# Altium project AMC_FMC_Carrier v3.PrjPcb (part 1 of 4)
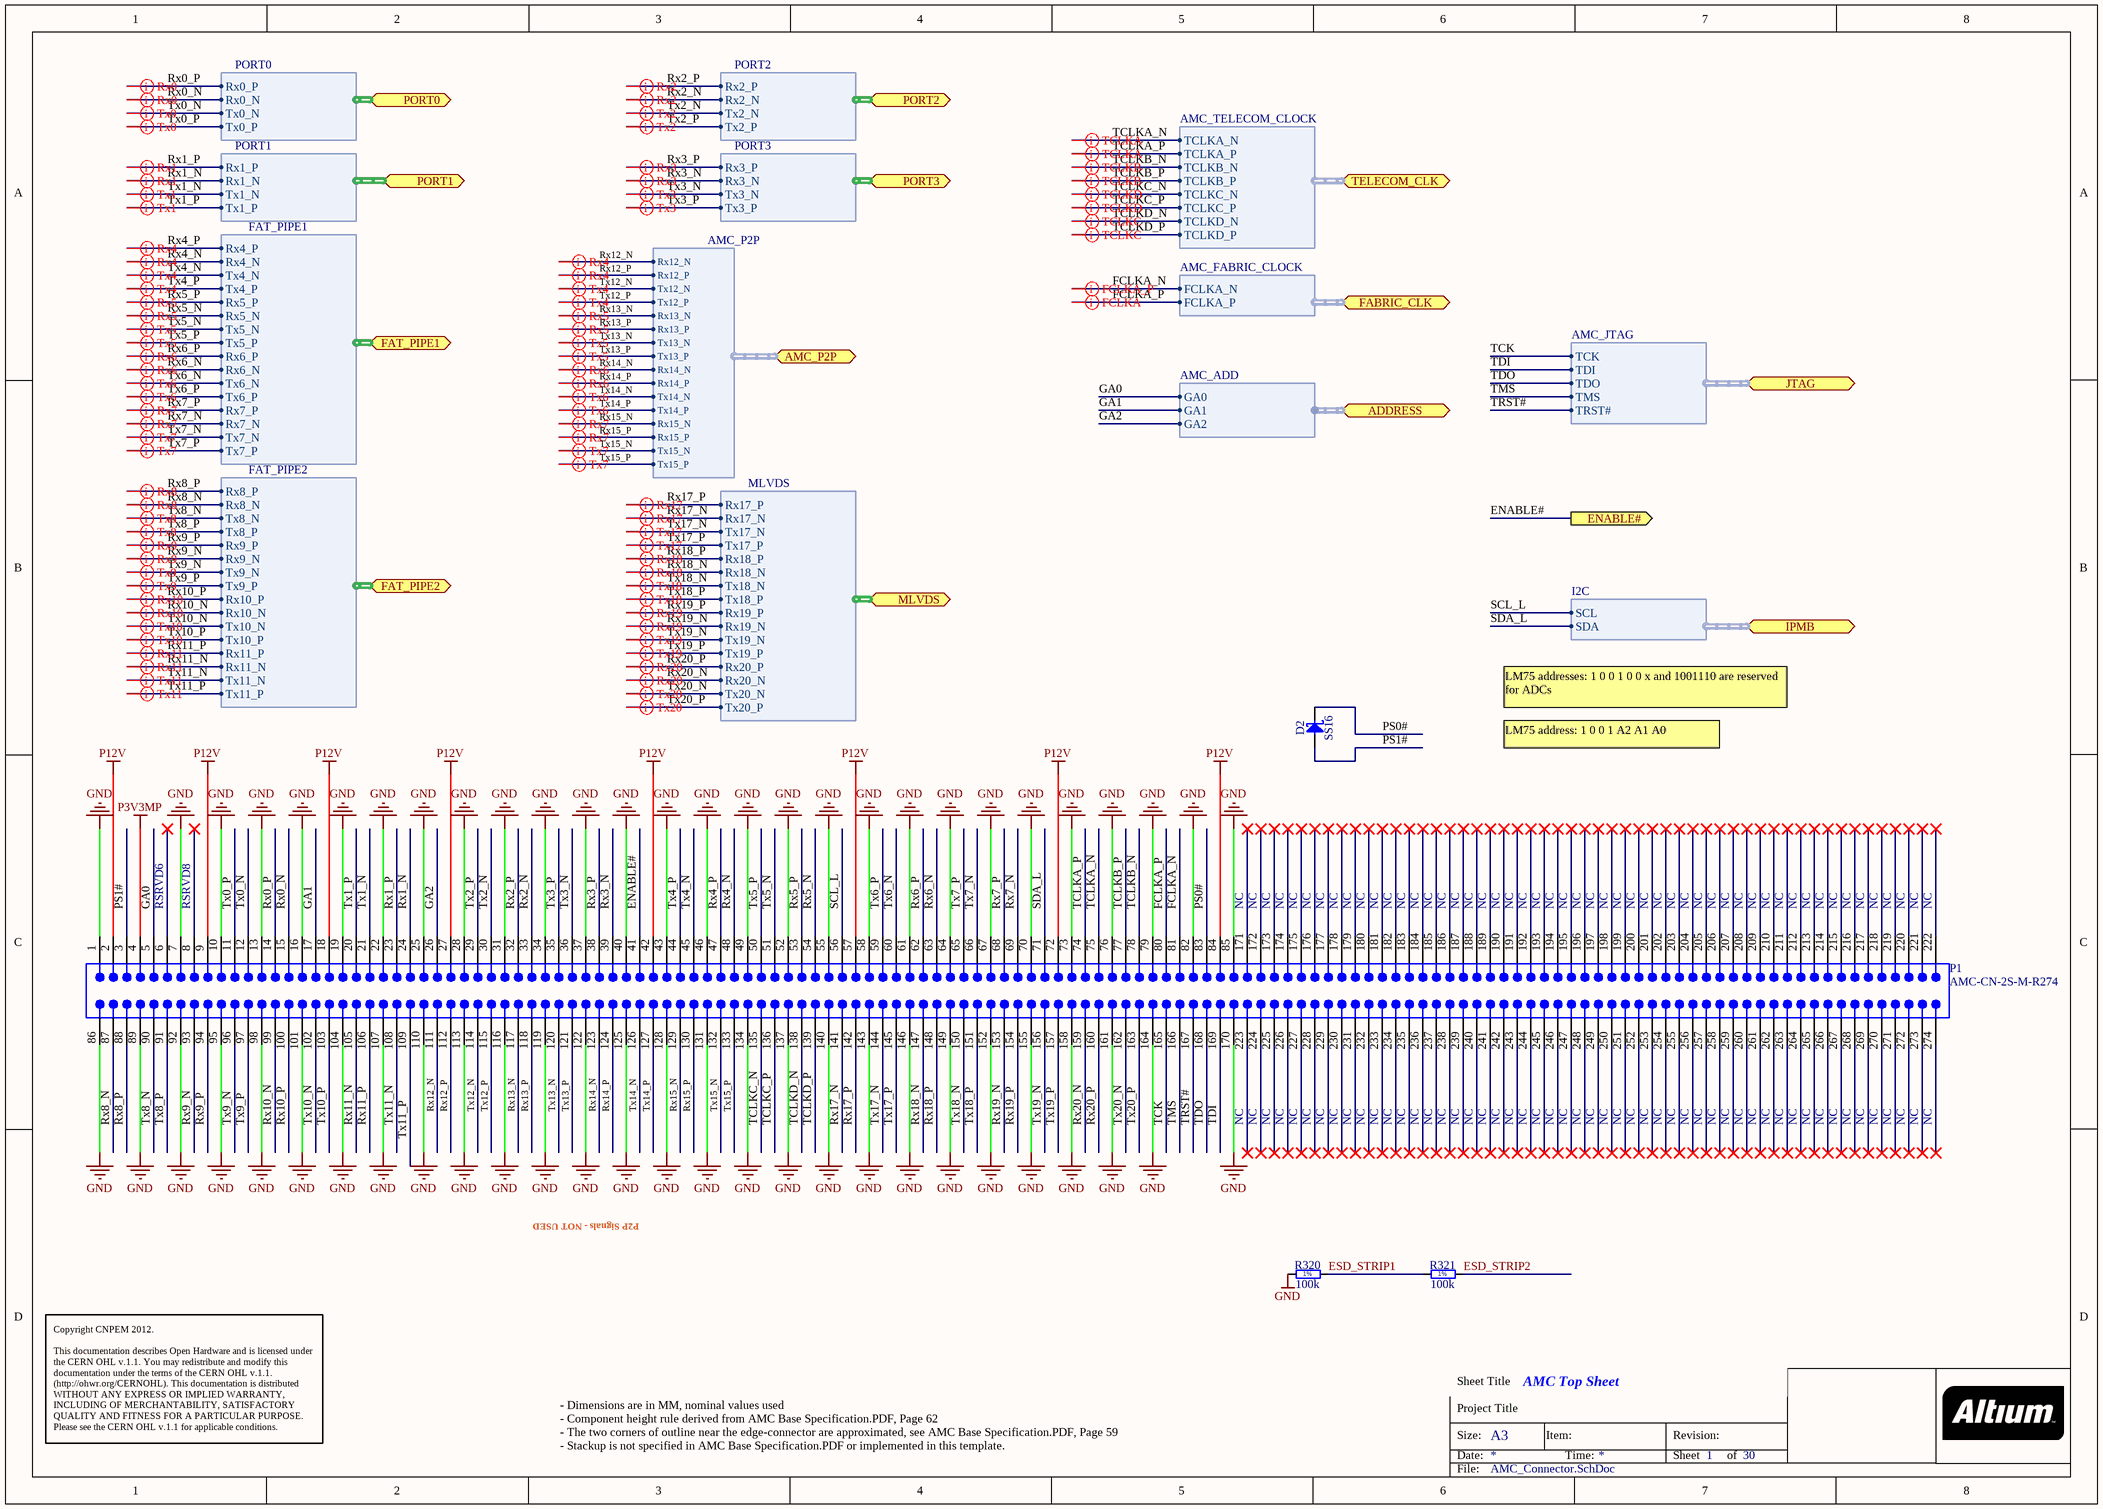
[diagram p0: AMC_Connector.SchDoc]
11 sheets, 421 parts. Net scope: hierarchical (ports join the sheet entries above them; power ports are global).
Board file: AMC_FMC_Carrier_v3.PcbDoc
Sheets:
  AMC_Connector.SchDoc
  FPGA.SchDoc
    FSDRAM = FPGA_SDRAM.SchDoc
    FMGT = FPGA_MGT.SchDoc
  POWER_Management.SchDoc
    SUP_12_18 = SUP_1.2_1.8.SchDoc
    UI = UI_mon.SchDoc
  RTM_CON.SchDoc
  AMC-SATA.SchDoc
  RTCE.SchDoc
  FMC_connector.SchDoc

## Sheet AMC_Connector.SchDoc: AMC Top Sheet
size A3; DocumentNumber: 1; Revision: 5; SheetNumber: 1; SheetTotal: 30; Organization: Altium Limited.

### Parts
D2  SS16  [DIOM5127X229N]
P1  AMC-CN-2S-M-R274  [AMC-GF-2D-750-O274]  (no BOM)
R320  100k  [RESC3216X65N]
R321  100k  [RESC3216X65N]

### Ports
ADDRESS (harness AMC_ADD), AMC_P2P (harness AMC_P2P), ENABLE# (out), FABRIC_CLK (harness AMC_FABRIC_CLOCK), FAT_PIPE1 (harness FAT_PIPE1), FAT_PIPE2 (harness FAT_PIPE2), IPMB (harness I2C), JTAG (harness AMC_JTAG), MLVDS (harness MLVDS), PORT0 (harness PORT0), PORT1 (harness PORT1), PORT2 (harness PORT2), PORT3 (harness PORT3), TELECOM_CLK (harness AMC_TELECOM_CLOCK)

### Harnesses
AMC_JTAG: TCK, TDI, TDO, TMS, TRST#
AMC_TELECOM_CLOCK: TCLKA_N, TCLKA_P, TCLKB_N, TCLKB_P, TCLKC_N, TCLKC_P, TCLKD_N, TCLKD_P
AMC_FABRIC_CLOCK: FCLKA_N, FCLKA_P
I2C: SCL, SDA
PORT0: Rx0_P, Rx0_N, Tx0_N, Tx0_P
PORT1: Rx1_P, Rx1_N, Tx1_N, Tx1_P
FAT_PIPE1: Rx4_P, Rx4_N, Tx4_N, Tx4_P, Rx5_P, Rx5_N, Tx5_N, Tx5_P, Rx6_P, Rx6_N, Tx6_N, Tx6_P, Rx7_P, Rx7_N, Tx7_N, Tx7_P
FAT_PIPE2: Rx8_P, Rx8_N, Tx8_N, Tx8_P, Rx9_P, Rx9_N, Tx9_N, Tx9_P, Rx10_P, Rx10_N, Tx10_N, Tx10_P, Rx11_P, Rx11_N, Tx11_N, Tx11_P
MLVDS: Rx17_P, Rx17_N, Tx17_N, Tx17_P, Rx18_P, Rx18_N, Tx18_N, Tx18_P, Rx19_P, Rx19_N, Tx19_N, Tx19_P, Rx20_P, Rx20_N, Tx20_N, Tx20_P
PORT2: Rx2_P, Rx2_N, Tx2_N, Tx2_P
PORT3: Rx3_P, Rx3_N, Tx3_N, Tx3_P
AMC_ADD: GA0, GA1, GA2
AMC_P2P: Rx12_N, Rx12_P, Tx12_N, Tx12_P, Rx13_N, Rx13_P, Tx13_N, Tx13_P, Rx14_N, Rx14_P, Tx14_N, Tx14_P, Rx15_N, Rx15_P, Tx15_N, Tx15_P

### Nets
GND: P1.1 P1.7 P1.10 P1.13 P1.16 P1.19 P1.22 P1.25 P1.28 P1.31 P1.34 P1.37 P1.40 P1.43 P1.46 P1.49 P1.52 P1.55 P1.58 P1.61 P1.64 P1.67 P1.70 P1.73 P1.76 P1.79 P1.82 P1.85 P1.86 P1.89 P1.92 P1.95 P1.98 P1.101 P1.104 P1.107 P1.110 P1.113 P1.116 P1.119 P1.122 P1.125 P1.128 P1.131 P1.134 P1.137 P1.140 P1.143 P1.146 P1.149 P1.152 P1.155 P1.158 P1.161 P1.164 P1.170 R320.1
P3V3MP: P1.4
P12V: P1.2 P1.9 P1.18 P1.27 P1.42 P1.57 P1.72 P1.84
ENABLE#: P1.41 ; port ENABLE#
ESD_STRIP1: R320.2 R321.1
ESD_STRIP2: R321.2
FCLKA_N: P1.81 ; port FABRIC_CLK.FCLKA_N
FCLKA_P: P1.80 ; port FABRIC_CLK.FCLKA_P
GA0: P1.5 ; port ADDRESS.GA0
GA1: P1.17 ; port ADDRESS.GA1
GA2: P1.26 ; port ADDRESS.GA2
PS0#: D2.1(C) P1.83
PS1#: D2.2(A) P1.3
Rx0_N: P1.15 ; port PORT0.Rx0_N
Rx0_P: P1.14 ; port PORT0.Rx0_P
Rx1_N: P1.24 ; port PORT1.Rx1_N
Rx1_P: P1.23 ; port PORT1.Rx1_P
Rx2_N: P1.33 ; port PORT2.Rx2_N
Rx2_P: P1.32 ; port PORT2.Rx2_P
Rx3_N: P1.39 ; port PORT3.Rx3_N
Rx3_P: P1.38 ; port PORT3.Rx3_P
Rx4_N: P1.48 ; port FAT_PIPE1.Rx4_N
Rx4_P: P1.47 ; port FAT_PIPE1.Rx4_P
Rx5_N: P1.54 ; port FAT_PIPE1.Rx5_N
Rx5_P: P1.53 ; port FAT_PIPE1.Rx5_P
Rx6_N: P1.63 ; port FAT_PIPE1.Rx6_N
Rx6_P: P1.62 ; port FAT_PIPE1.Rx6_P
Rx7_N: P1.69 ; port FAT_PIPE1.Rx7_N
Rx7_P: P1.68 ; port FAT_PIPE1.Rx7_P
Rx8_N: P1.87 ; port FAT_PIPE2.Rx8_N
Rx8_P: P1.88 ; port FAT_PIPE2.Rx8_P
Rx9_N: P1.93 ; port FAT_PIPE2.Rx9_N
Rx9_P: P1.94 ; port FAT_PIPE2.Rx9_P
Rx10_N: P1.99 ; port FAT_PIPE2.Rx10_N
Rx10_P: P1.100 ; port FAT_PIPE2.Rx10_P
Rx11_N: P1.105 ; port FAT_PIPE2.Rx11_N
Rx11_P: P1.106 ; port FAT_PIPE2.Rx11_P
Rx12_N: P1.111 ; port AMC_P2P.Rx12_N
Rx12_P: P1.112 ; port AMC_P2P.Rx12_P
Rx13_N: P1.117 ; port AMC_P2P.Rx13_N
Rx13_P: P1.118 ; port AMC_P2P.Rx13_P
Rx14_N: P1.123 ; port AMC_P2P.Rx14_N
Rx14_P: P1.124 ; port AMC_P2P.Rx14_P
Rx15_N: P1.129 ; port AMC_P2P.Rx15_N
Rx15_P: P1.130 ; port AMC_P2P.Rx15_P
Rx17_N: P1.141 ; port MLVDS.Rx17_N
Rx17_P: P1.142 ; port MLVDS.Rx17_P
Rx18_N: P1.147 ; port MLVDS.Rx18_N
Rx18_P: P1.148 ; port MLVDS.Rx18_P
Rx19_N: P1.153 ; port MLVDS.Rx19_N
Rx19_P: P1.154 ; port MLVDS.Rx19_P
Rx20_N: P1.159 ; port MLVDS.Rx20_N
Rx20_P: P1.160 ; port MLVDS.Rx20_P
SCL_L: P1.56 ; port IPMB.SCL
SDA_L: P1.71 ; port IPMB.SDA
TCK: P1.165 ; port JTAG.TCK
TCLKA_N: P1.75 ; port TELECOM_CLK.TCLKA_N
TCLKA_P: P1.74 ; port TELECOM_CLK.TCLKA_P
TCLKB_N: P1.78 ; port TELECOM_CLK.TCLKB_N
TCLKB_P: P1.77 ; port TELECOM_CLK.TCLKB_P
TCLKC_N: P1.135 ; port TELECOM_CLK.TCLKC_N
TCLKC_P: P1.136 ; port TELECOM_CLK.TCLKC_P
TCLKD_N: P1.138 ; port TELECOM_CLK.TCLKD_N
TCLKD_P: P1.139 ; port TELECOM_CLK.TCLKD_P
TDI: P1.169 ; port JTAG.TDI
TDO: P1.168 ; port JTAG.TDO
TMS: P1.166 ; port JTAG.TMS
TRST#: P1.167 ; port JTAG.TRST#
Tx0_N: P1.12 ; port PORT0.Tx0_N
Tx0_P: P1.11 ; port PORT0.Tx0_P
Tx1_N: P1.21 ; port PORT1.Tx1_N
Tx1_P: P1.20 ; port PORT1.Tx1_P
Tx2_N: P1.30 ; port PORT2.Tx2_N
Tx2_P: P1.29 ; port PORT2.Tx2_P
Tx3_N: P1.36 ; port PORT3.Tx3_N
Tx3_P: P1.35 ; port PORT3.Tx3_P
Tx4_N: P1.45 ; port FAT_PIPE1.Tx4_N
Tx4_P: P1.44 ; port FAT_PIPE1.Tx4_P
Tx5_N: P1.51 ; port FAT_PIPE1.Tx5_N
Tx5_P: P1.50 ; port FAT_PIPE1.Tx5_P
Tx6_N: P1.60 ; port FAT_PIPE1.Tx6_N
Tx6_P: P1.59 ; port FAT_PIPE1.Tx6_P
Tx7_N: P1.66 ; port FAT_PIPE1.Tx7_N
Tx7_P: P1.65 ; port FAT_PIPE1.Tx7_P
Tx8_N: P1.90 ; port FAT_PIPE2.Tx8_N
Tx8_P: P1.91 ; port FAT_PIPE2.Tx8_P
Tx9_N: P1.96 ; port FAT_PIPE2.Tx9_N
Tx9_P: P1.97 ; port FAT_PIPE2.Tx9_P
Tx10_N: P1.102 ; port FAT_PIPE2.Tx10_N
Tx10_P: P1.103 ; port FAT_PIPE2.Tx10_P
Tx11_N: P1.108 ; port FAT_PIPE2.Tx11_N
Tx11_P: P1.109 ; port FAT_PIPE2.Tx11_P
Tx12_N: P1.114 ; port AMC_P2P.Tx12_N
Tx12_P: P1.115 ; port AMC_P2P.Tx12_P
Tx13_N: P1.120 ; port AMC_P2P.Tx13_N
Tx13_P: P1.121 ; port AMC_P2P.Tx13_P
Tx14_N: P1.126 ; port AMC_P2P.Tx14_N
Tx14_P: P1.127 ; port AMC_P2P.Tx14_P
Tx15_N: P1.132 ; port AMC_P2P.Tx15_N
Tx15_P: P1.133 ; port AMC_P2P.Tx15_P
Tx17_N: P1.144 ; port MLVDS.Tx17_N
Tx17_P: P1.145 ; port MLVDS.Tx17_P
Tx18_N: P1.150 ; port MLVDS.Tx18_N
Tx18_P: P1.151 ; port MLVDS.Tx18_P
Tx19_N: P1.156 ; port MLVDS.Tx19_N
Tx19_P: P1.157 ; port MLVDS.Tx19_P
Tx20_N: P1.162 ; port MLVDS.Tx20_N
Tx20_P: P1.163 ; port MLVDS.Tx20_P

Not connected (* = marked no-connect by the designer): P1 6* 8* 171* 172* 173* 174* 175* 176* 177* 178* 179* 180* 181* 182* 183* 184* 185* 186* 187* 188* 189* 190* 191* 192* 193* 194* 195* 196* 197* 198* 199* 200* 201* 202* 203* 204* 205* 206* 207* 208* 209* 210* 211* 212* 213* 214* 215* 216* 217* 218* 219* 220* 221* 222* 223* 224* 225* 226* 227* 228* 229* 230* 231* 232* 233* 234* 235* 236* 237* 238* 239* 240* 241* 242* 243* 244* 245* 246* 247* 248* 249* 250* 251* 252* 253* 254* 255* 256* 257* 258* 259* 260* 261* 262* 263* 264* 265* 266* 267* 268* 269* 270* 271* 272* 273* 274*

### Layout directives
differential pair: FCLKA_N, FCLKA_P, Rx0_N, Rx0_P, Rx1_N, Rx1_P, Rx2_N, Rx2_P, Rx3_N, Rx3_P, Rx4_N, Rx4_P, Rx5_N, Rx5_P, Rx6_N, Rx6_P, Rx7_N, Rx7_P, Rx8_N, Rx8_P, Rx9_N, Rx9_P, Rx10_N, Rx10_P, Rx11_N, Rx11_P, Rx12_N, Rx12_P, Rx13_N, Rx13_P, Rx14_N, Rx14_P, Rx15_N, Rx15_P, Rx17_N, Rx17_P, Rx18_N, Rx18_P, Rx19_N, Rx19_P, Rx20_N, Rx20_P, TCLKA_N, TCLKA_P, TCLKB_N, TCLKB_P, TCLKC_N, TCLKC_P, TCLKD_N, TCLKD_P, Tx0_N, Tx0_P, Tx1_N, Tx1_P, Tx2_N, Tx2_P, Tx3_N, Tx3_P, Tx4_N, Tx4_P, Tx5_N, Tx5_P, Tx6_N, Tx6_P, Tx7_N, Tx7_P, Tx8_N, Tx8_P, Tx9_N, Tx9_P, Tx10_N, Tx10_P, Tx11_N, Tx11_P, Tx12_N, Tx12_P, Tx13_N, Tx13_P, Tx14_N, Tx14_P, Tx15_N, Tx15_P, Tx17_N, Tx17_P, Tx18_N, Tx18_P, Tx19_N, Tx19_P, Tx20_N, Tx20_P

### Notes on the sheet
- LM75 addresses: 1 0 0 1 0 0 x and 1001110 are reserved for ADCs
- LM75 address: 1 0 0 1 A2 A1 A0
- RSRVD6
- RSRVD8
- NC
- P2P Signals - NOT USED
- Copyright CNPEM 2012.
  This documentation describes Open Hardware and is licensed under the CERN OHL v.1.1. You may redistribute and modify this documentation under the terms of the CERN OHL v.1.1. (http://ohwr.org/CERNOHL). This documentation is distributed WITHOUT ANY EXPRESS OR IMPLIED WARRANTY, INCLUDING OF MERCHANTABILITY, SATISFACTORY QUALITY AND FITNESS FOR A PARTICULAR PURPOSE. Please see the CERN OHL v.1.1 for applicable conditions.
- - Dimensions are in MM, nominal values used
  - Component height rule derived from AMC Base Specification.PDF, Page 62
  - The two corners of outline near the edge-connector are approximated, see AMC Base Specification.PDF, Page 59
  - Stackup is not specified in AMC Base Specification.PDF or implemented in this template.
- Sheet Title
- Project Title
- Size:
- Date:
- A3
- Item:
- Time:
- Revision:
- Sheet
- of
- File:
- (in symbol R1206_100K_1%_0.25W_100PPM) 1%

### Library data of the parts
D2 = SS16: Schottky Diode; Part Description: Surface Mount Schottky Barrier Rectifier; Manufacturer: VISHAY GENERAL SEMICONDUCTOR; Voltage: 60V; Power: 1A; Table: Diodes; Part Number: SS16; Component Kind: Standard; Component Type: Standard; Device: SS16; PackageDescription: DO-214-AC Molded Diode, Body 5.1x2.7mm, IPC Medium Density; Manufacturer Part Number: SS16; Pin Count: 2; Case: DO-214AC; Mounted: Yes; Socket: No; SMD: Yes; ComponentHeight: 2.29mm; HelpURL: \\cern.ch\dfs\Applications\Altium\Datasheets\SS16.pdf; Author: CERN DEM JLC; CreateDate: 2008-07-15; LatestRevisionDate: 2010-08-23
P1 = CMP-0001-00058-2: Golden finger, AMC, Dual, Opposite, Pitch 0.75mm, 170-Position; Package Version: rev2.0, Nov-2006; Mating Connector: Molex-0758000001; Datasheet Version: rev2.0, Nov-2006; ClassName: Edge Connector; Package Reference: AMC-GF-2D-750-O274; Publisher: Altium
R320 R321 = R1206_100K_1%_0.25W_100PPM: Resistor - 1%; Part Description: General Purpose Thick Film Chip Resistor; Manufacturer: GENERIC; Manufacturer1 Part Number: NRC12F1003TRF; Power: 0.25W; TC: ±100ppm/°C; Table: Resistors SMD; Part Number: R1206_100K_1%_0.25W_100PPM; Component Kind: Standard; Component Type: Standard; Pin Count: 2; Value: 100k; Status: Preferred; Tolerance: ±1%; Manufacturer Part Number: R1206_100K_1%_0.25W_100PPM; Case: 1206; Mounted: Yes; Socket: No; SMD: Yes; Manufacturer1 Example: NIC COMPONENT; Manufacturer1 ComponentHeight: 0.65mm; HelpURL: \\cern.ch\dfs\Applications\Altium\Datasheets\R1206_NIC_NRC.pdf; Author: CERN DEM JLC; CreateDate: 2007-12-03; LatestRevisionDate: 2008-03-13

## Sheet FPGA.SchDoc
size A3; DocumentNumber: 4; SheetNumber: 4; SheetTotal: 30
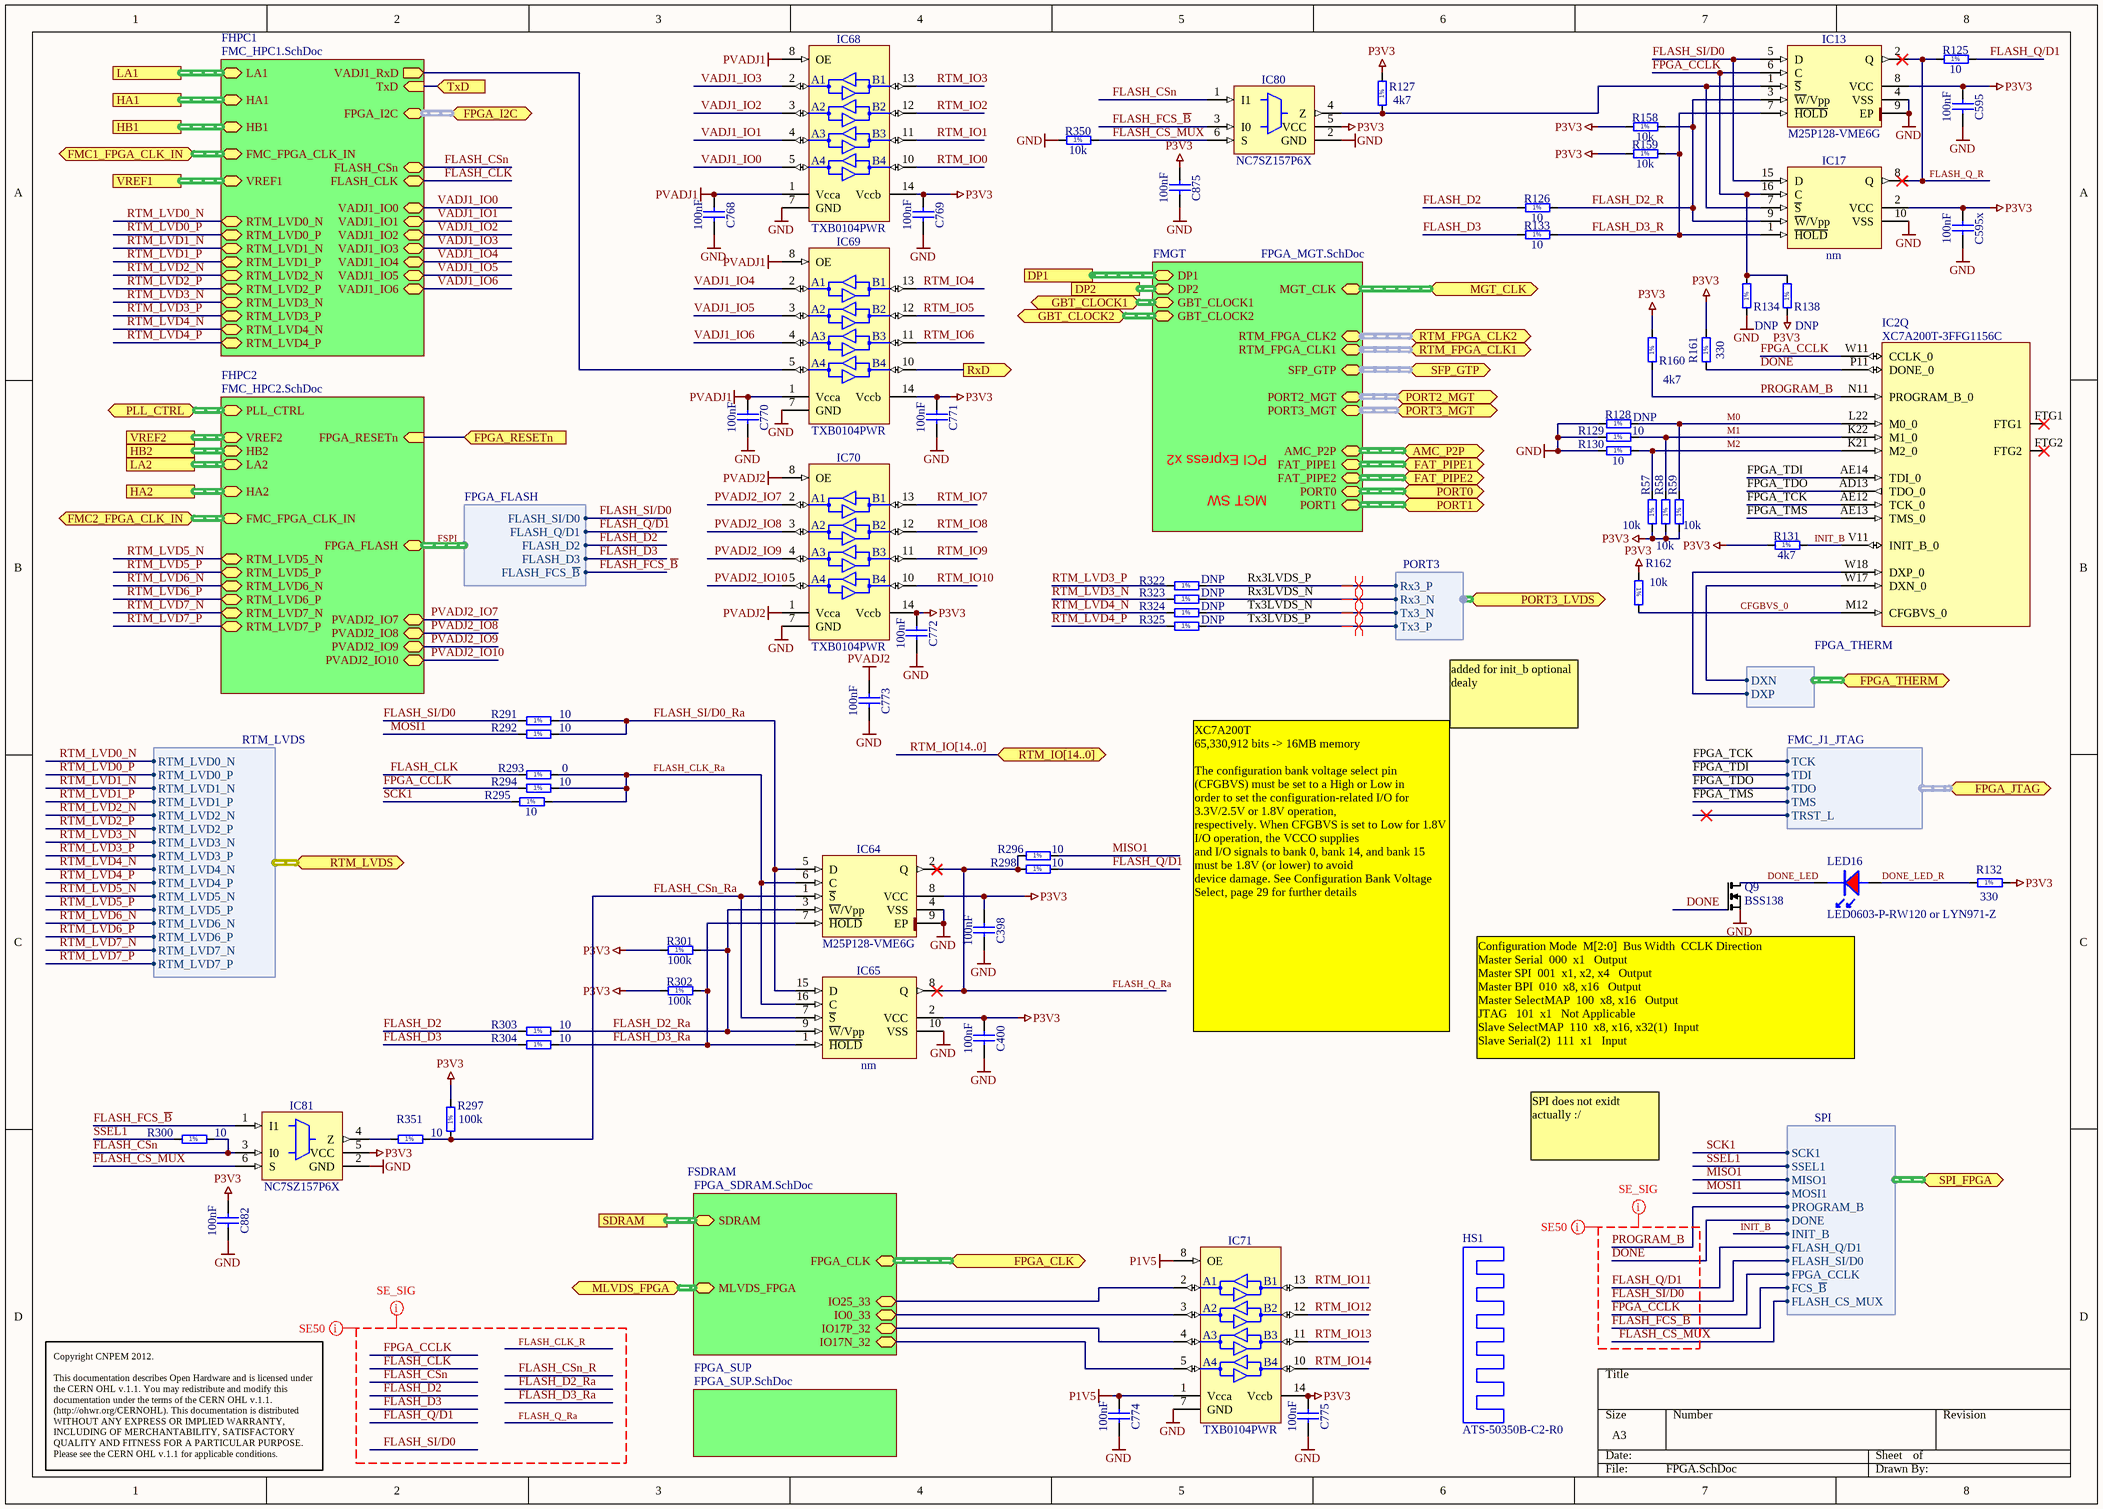
[diagram p1: FPGA.SchDoc]

### Parts
(Parts that share a designator on the sheet are numbered #1, #2 ... from top to bottom, then left to right.)
C398  100nF  [CAPC0603X33N]
C400  100nF  [CAPC0603X33N]
C595  100nF  [CAPC0603X33N]
C595x  100nF  [CAPC0603X33N]
C768  100nF  [CAPC0603X33N]
C769  100nF  [CAPC0603X33N]
C770  100nF  [CAPC0603X33N]
C771  100nF  [CAPC0603X33N]
C772  100nF  [CAPC0603X33N]
C773  100nF  [CAPC0603X33N]
C774  100nF  [CAPC0603X33N]
C775  100nF  [CAPC0603X33N]
C875  100nF  [CAPC0603X33N]
C882  100nF  [CAPC0603X33N]
HS1  ATS-50350B-C2-R0  [HEAT_SINK_ATS-50350B-C2-R0]
IC2#1  XC7A200T-3FFG1156C  [BGA1156C100P34X34_3500X3500X335]  (part Q of 23)
IC13  M25P128-VME6G  [PSON127P800X600X100-9N-R640X480]
IC17  nm  [SOIC127P1030X265-16N]
IC64  M25P128-VME6G  [PSON127P800X600X100-9N-R640X480]
IC65  nm  [SOIC127P1030X265-16N]
IC68  TXB0104PWR  [SOP65P640X120-14N]
IC69  TXB0104PWR  [SOP65P640X120-14N]
IC70  TXB0104PWR  [SOP65P640X120-14N]
IC71  TXB0104PWR  [SOP65P640X120-14N]
IC80  NC7SZ157P6X  [SOT65P210X110-6N]
IC81  NC7SZ157P6X  [SOT65P210X110-6N]
LED16  LED0603-P-RW120 or LYN971-Z  [led_0603R]
Q9  BSS138  [SOT95P251X112-3N]
R57  10k  [RESC1005X40N]
R58  10k  [RESC1005X40N]
R59  10k  [RESC1005X40N]
R125  10  [RESC1005X40N]
R126  10  [RESC1005X40N]
R127  4k7  [RESC1005X40N]
R128  DNP  [RESC1005X40N]
R129  10  [RESC1005X40N]
R130  10  [RESC1005X40N]
R131  4k7  [RESC1005X40N]
R132  330  [RESC1005X40N]
R133  10  [RESC1005X40N]
R134  DNP  [RESC1005X40N]
R138  DNP  [RESC1005X40N]
R158  10k  [RESC1005X40N]
R159  10k  [RESC1005X40N]
R160  4k7  [RESC1005X40N]
R161  330  [RESC1005X40N]
R162  10k  [RESC1005X40N]
R291  10  [RESC1005X40N]
R292  10  [RESC1005X40N]
R293  0  [RESC1005X40N]
R294  10  [RESC1005X40N]
R295  10  [RESC1005X40N]
R296  10  [RESC1005X40N]
R297  100k  [RESC1005X40N]
R298  10  [RESC1005X40N]
R300  10  [RESC1005X40N]
R301  100k  [RESC1005X40N]
R302  100k  [RESC1005X40N]
R303  10  [RESC1005X40N]
R304  10  [RESC1005X40N]
R322  DNP  [RESC1005X40N]
R323  DNP  [RESC1005X40N]
R324  DNP  [RESC1005X40N]
R325  DNP  [RESC1005X40N]
R350  10k  [RESC1005X40N]
R351  10  [RESC1005X40N]

### Sub-sheets
FHPC1 = FMC_HPC1.SchDoc (file not in this document): LA1 (harness FMC_J1_LA), HA1 (harness FMC_J1_HA), HB1 (harness FMC_J1_HB), VREF1 (harness FMC_J1_VREF), FMC_FPGA_CLK_IN (harness FMC_FPGA_CLK_IN), FPGA_I2C (harness I2C), FLASH_CLK, FLASH_CSn, VADJ1_RxD (out), TxD (in), VADJ1_IO0, VADJ1_IO1, VADJ1_IO2, VADJ1_IO3, VADJ1_IO4, VADJ1_IO5, VADJ1_IO6, RTM_LVD0_N (bidir), RTM_LVD0_P (bidir), RTM_LVD1_N (bidir), RTM_LVD1_P (bidir), RTM_LVD2_N (bidir), RTM_LVD2_P (bidir), RTM_LVD3_N (bidir), RTM_LVD3_P (bidir), RTM_LVD4_N (bidir), RTM_LVD4_P (bidir)
FHPC2 = FMC_HPC2.SchDoc (file not in this document): VREF2 (harness FMC_J1_VREF), HB2 (harness FMC_J1_HB), LA2 (harness FMC_J1_LA), HA2 (harness FMC_J1_HA), FPGA_FLASH (harness FPGA_FLASH), FMC_FPGA_CLK_IN (harness FMC_FPGA_CLK_IN), PLL_CTRL (harness PLL_CTRL), FPGA_RESETn (in), PVADJ2_IO7, PVADJ2_IO8, PVADJ2_IO9, PVADJ2_IO10, RTM_LVD5_N (bidir), RTM_LVD5_P (bidir), RTM_LVD6_N (bidir), RTM_LVD6_P (bidir), RTM_LVD7_N (bidir), RTM_LVD7_P (bidir)
FMGT = FPGA_MGT.SchDoc: DP1 (harness FMC_J1_DP), DP2 (harness FMC_J1_DP), FAT_PIPE1 (harness FAT_PIPE1), FAT_PIPE2 (harness FAT_PIPE2), PORT0 (harness PORT0), PORT1 (harness PORT1), GBT_CLOCK1 (harness GBT_CLOCK), GBT_CLOCK2 (harness GBT_CLOCK), MGT_CLK (harness MGT_CLK), PORT2_MGT, PORT3_MGT, SFP_GTP, RTM_FPGA_CLK2 (harness CLK_DIFF), RTM_FPGA_CLK1 (harness CLK_DIFF), AMC_P2P
FPGA_SUP = FPGA_SUP.SchDoc (file not in this document): no entries
FSDRAM = FPGA_SDRAM.SchDoc: SDRAM (harness DDR), MLVDS_FPGA (harness MLVDS-FPGA), FPGA_CLK (harness FPGA_SDRAM_CLK), IO25_33 (bidir), IO0_33 (bidir), IO17N_32 (bidir), IO17P_32 (bidir)

### Ports
AMC_P2P (harness AMC_P2P), DP1, DP2, FAT_PIPE1, FAT_PIPE2, FMC1_FPGA_CLK_IN, FMC2_FPGA_CLK_IN, FPGA_CLK, FPGA_I2C (harness I2C), FPGA_JTAG (harness FMC_J1_JTAG), FPGA_RESETn (in), FPGA_THERM (harness FPGA_THERM), GBT_CLOCK1, GBT_CLOCK2, HA1, HA2, HB1, HB2, LA1, LA2, MGT_CLK, MLVDS_FPGA, PLL_CTRL (harness PLL_CTRL), PORT0, PORT1, PORT2_MGT (harness PORT2), PORT3_LVDS (harness PORT3), PORT3_MGT (harness PORT3), RTM_FPGA_CLK1 (harness CLK_DIFF), RTM_FPGA_CLK2 (harness CLK_DIFF), RTM_IO[14..0] (bidir), RTM_LVDS (harness RTM_LVDS), RxD (out), SDRAM (harness DDR), SFP_GTP (harness SFP_GTP), SPI_FPGA (harness SPI), TxD (in), VREF1 (harness FMC_J1_VREF), VREF2 (harness FMC_J1_VREF)

### Harnesses
FMC_J1_JTAG: TCK, TDI, TDO, TMS, TRST_L
FPGA_THERM: DXN, DXP
SPI: SCK1, SSEL1, MISO1, MOSI1, FLASH_Q/D1, FLASH_SI/D0, PROGRAM_B, DONE, FPGA_CCLK, FCS_~{B}, INIT_B, FLASH_CS_MUX
FPGA_FLASH: FLASH_FCS_~{B}, FLASH_D3, FLASH_D2, FLASH_Q/D1, FLASH_SI/D0
RTM_LVDS: RTM_LVD0_N, RTM_LVD0_P, RTM_LVD1_N, RTM_LVD1_P, RTM_LVD2_N, RTM_LVD2_P, RTM_LVD3_N, RTM_LVD3_P, RTM_LVD4_N, RTM_LVD4_P, RTM_LVD5_N, RTM_LVD5_P, RTM_LVD6_N, RTM_LVD6_P, RTM_LVD7_N, RTM_LVD7_P
PORT3: Rx3_P, Rx3_N, Tx3_N, Tx3_P

### Nets
GND: C398.2 C400.2 C595.2 C595x.2 C768.2 C769.2 C770.2 C771.2 C772.2 C773.2 C774.2 C775.2 C875.2 C882.2 IC13.4(VSS) IC13.9(EP) IC17.10(VSS) IC64.4(VSS) IC64.9(EP) IC65.10(VSS) IC68.7(GND) IC69.7(GND) IC70.7(GND) IC71.7(GND) IC80.2(GND) IC81.2(GND) Q9.2(S) R128.1 R129.1 R130.1 R134.1 R350.1
P1V5: C774.1 IC71.1(Vcca) IC71.8(OE)
P3V3: C398.1 C400.1 C595.1 C595x.1 C769.1 C771.1 C772.1 C775.1 C875.1 C882.1 IC13.8(VCC) IC17.2(VCC) IC64.8(VCC) IC65.2(VCC) IC68.14(Vccb) IC69.14(Vccb) IC70.14(Vccb) IC71.14(Vccb) IC80.5(VCC) IC81.5(VCC) R57.1 R58.1 R59.1 R127.2 R131.1 R132.2 R138.1 R158.1 R159.1 R160.2 R161.2 R162.1 R297.2 R301.1 R302.1  [also labelled VCC]
PVADJ1: C768.1 C770.1 IC68.1(Vcca) IC68.8(OE) IC69.1(Vcca) IC69.8(OE)
PVADJ2: C773.1 IC70.1(Vcca) IC70.8(OE)
CFGBVS_0: IC2#1.M12(CFGBVS_0) R162.2
DONE: IC2#1.P11(DONE_0) Q9.1(G) R161.1 ; port SPI_FPGA.DONE
DONE_LED: LED16.K Q9.3(D)
DONE_LED_R: LED16.A R132.1
FLASH_CLK: R293.1 ; sheet FHPC1/FLASH_CLK
FLASH_CLK_Ra: IC64.6(C) IC65.16(C) R293.2 R294.2 R295.2
FLASH_CS_MUX: IC80.6(S) IC81.6(S) R350.2 ; port SPI_FPGA.FLASH_CS_MUX
FLASH_CSn: IC80.1(I1) IC81.3(I0) R300.2 ; sheet FHPC1/FLASH_CSn
FLASH_CSn_Ra: IC64.1(~{S}) IC65.7(~{S}) R297.1 R351.2
FLASH_D2: R126.1 R303.1 ; sheet FHPC2/FPGA_FLASH.FLASH_D2
FLASH_D2_R: IC13.3(~{W}/Vpp) IC17.9(~{W}/Vpp) R126.2 R158.2
FLASH_D2_Ra: IC64.3(~{W}/Vpp) IC65.9(~{W}/Vpp) R301.2 R303.2
FLASH_D3: R133.1 R304.1 ; sheet FHPC2/FPGA_FLASH.FLASH_D3
FLASH_D3_R: IC13.7(~{HOLD}) IC17.1(~{HOLD}) R133.2 R159.2
FLASH_D3_Ra: IC64.7(~{HOLD}) IC65.1(~{HOLD}) R302.2 R304.2
FLASH_FCS_~{B}: IC80.3(I0) IC81.1(I1) ; port SPI_FPGA.FCS_~{B}, sheet FHPC2/FPGA_FLASH.FLASH_FCS_~{B}
FLASH_Q/D1: R125.2 R298.2 ; port SPI_FPGA.FLASH_Q/D1, sheet FHPC2/FPGA_FLASH.FLASH_Q/D1
FLASH_Q_R: IC13.2(Q) IC17.8(Q) R125.1
FLASH_Q_Ra: IC64.2(Q) IC65.8(Q) R296.1 R298.1
FLASH_SI/D0: IC13.5(D) IC17.15(D) R291.1 ; port SPI_FPGA.FLASH_SI/D0, sheet FHPC2/FPGA_FLASH.FLASH_SI/D0
FLASH_SI/D0_Ra: IC64.5(D) IC65.15(D) R291.2 R292.2
FPGA_CCLK: IC2#1.W11(CCLK_0) IC13.6(C) IC17.16(C) R134.2 R138.2 R294.1 ; port SPI_FPGA.FPGA_CCLK
FPGA_RESETn: port FPGA_RESETn, sheet FHPC2/FPGA_RESETn
FPGA_TCK: IC2#1.AE12(TCK_0) ; port FPGA_JTAG.TCK
FPGA_TDI: IC2#1.AE14(TDI_0) ; port FPGA_JTAG.TDI
FPGA_TDO: IC2#1.AD13(TDO_0) ; port FPGA_JTAG.TDO
FPGA_TMS: IC2#1.AE13(TMS_0) ; port FPGA_JTAG.TMS
INIT_B: IC2#1.V11(INIT_B_0) R131.2 ; port SPI_FPGA.INIT_B
IO0_33: IC71.3(A2) ; sheet FSDRAM/IO0_33
IO17N_32: IC71.5(A4) ; sheet FSDRAM/IO17N_32
IO17P_32: IC71.4(A3) ; sheet FSDRAM/IO17P_32
IO25_33: IC71.2(A1) ; sheet FSDRAM/IO25_33
M0: IC2#1.L22(M0_0) R59.2 R128.2
M1: IC2#1.K22(M1_0) R58.2 R129.2
M2: IC2#1.K21(M2_0) R57.2 R130.2
MISO1: R296.2 ; port SPI_FPGA.MISO1
MOSI1: R292.1 ; port SPI_FPGA.MOSI1
PROGRAM_B: IC2#1.N11(PROGRAM_B_0) R160.1 ; port SPI_FPGA.PROGRAM_B
PVADJ2_IO7: IC70.2(A1) ; sheet FHPC2/PVADJ2_IO7
PVADJ2_IO8: IC70.3(A2) ; sheet FHPC2/PVADJ2_IO8
PVADJ2_IO9: IC70.4(A3) ; sheet FHPC2/PVADJ2_IO9
PVADJ2_IO10: IC70.5(A4) ; sheet FHPC2/PVADJ2_IO10
RTM_IO0: IC68.10(B4)
RTM_IO1: IC68.11(B3)
RTM_IO2: IC68.12(B2)
RTM_IO3: IC68.13(B1)
RTM_IO4: IC69.13(B1)
RTM_IO5: IC69.12(B2)
RTM_IO6: IC69.11(B3)
RTM_IO7: IC70.13(B1)
RTM_IO8: IC70.12(B2)
RTM_IO9: IC70.11(B3)
RTM_IO10: IC70.10(B4)
RTM_IO11: IC71.13(B1)
RTM_IO12: IC71.12(B2)
RTM_IO13: IC71.11(B3)
RTM_IO14: IC71.10(B4)
RTM_LVD0_N: sheet FHPC1/RTM_LVD0_N, port RTM_LVDS.RTM_LVD0_N
RTM_LVD0_P: sheet FHPC1/RTM_LVD0_P, port RTM_LVDS.RTM_LVD0_P
RTM_LVD1_N: sheet FHPC1/RTM_LVD1_N, port RTM_LVDS.RTM_LVD1_N
RTM_LVD1_P: sheet FHPC1/RTM_LVD1_P, port RTM_LVDS.RTM_LVD1_P
RTM_LVD2_N: sheet FHPC1/RTM_LVD2_N, port RTM_LVDS.RTM_LVD2_N
RTM_LVD2_P: sheet FHPC1/RTM_LVD2_P, port RTM_LVDS.RTM_LVD2_P
RTM_LVD3_N: R323.1 ; sheet FHPC1/RTM_LVD3_N, port RTM_LVDS.RTM_LVD3_N
RTM_LVD3_P: R322.1 ; sheet FHPC1/RTM_LVD3_P, port RTM_LVDS.RTM_LVD3_P
RTM_LVD4_N: R324.1 ; sheet FHPC1/RTM_LVD4_N, port RTM_LVDS.RTM_LVD4_N
RTM_LVD4_P: R325.1 ; sheet FHPC1/RTM_LVD4_P, port RTM_LVDS.RTM_LVD4_P
RTM_LVD5_N: sheet FHPC2/RTM_LVD5_N, port RTM_LVDS.RTM_LVD5_N
RTM_LVD5_P: sheet FHPC2/RTM_LVD5_P, port RTM_LVDS.RTM_LVD5_P
RTM_LVD6_N: sheet FHPC2/RTM_LVD6_N, port RTM_LVDS.RTM_LVD6_N
RTM_LVD6_P: sheet FHPC2/RTM_LVD6_P, port RTM_LVDS.RTM_LVD6_P
RTM_LVD7_N: sheet FHPC2/RTM_LVD7_N, port RTM_LVDS.RTM_LVD7_N
RTM_LVD7_P: sheet FHPC2/RTM_LVD7_P, port RTM_LVDS.RTM_LVD7_P
Rx3LVDS_N: R323.2 ; port PORT3_LVDS.Rx3_N
Rx3LVDS_P: R322.2 ; port PORT3_LVDS.Rx3_P
RxD: IC69.10(B4) ; port RxD
SCK1: R295.1 ; port SPI_FPGA.SCK1
SSEL1: R300.1 ; port SPI_FPGA.SSEL1
Tx3LVDS_N: R324.2 ; port PORT3_LVDS.Tx3_N
Tx3LVDS_P: R325.2 ; port PORT3_LVDS.Tx3_P
TxD: port TxD, sheet FHPC1/TxD
VADJ1_IO0: IC68.5(A4) ; sheet FHPC1/VADJ1_IO0
VADJ1_IO1: IC68.4(A3) ; sheet FHPC1/VADJ1_IO1
VADJ1_IO2: IC68.3(A2) ; sheet FHPC1/VADJ1_IO2
VADJ1_IO3: IC68.2(A1) ; sheet FHPC1/VADJ1_IO3
VADJ1_IO4: IC69.2(A1) ; sheet FHPC1/VADJ1_IO4
VADJ1_IO5: IC69.3(A2) ; sheet FHPC1/VADJ1_IO5
VADJ1_IO6: IC69.4(A3) ; sheet FHPC1/VADJ1_IO6
NetIC2#1_W17: IC2#1.W17(DXN_0) ; port FPGA_THERM.DXN
NetIC2#1_W18: IC2#1.W18(DXP_0) ; port FPGA_THERM.DXP
NetIC13_1: IC13.1(~{S}) IC17.7(~{S}) IC80.4(Z) R127.1
NetIC69_5: IC69.5(A4) ; sheet FHPC1/VADJ1_RxD
NetIC81_4: IC81.4(Z) R351.1

Not connected (* = marked no-connect by the designer): IC2#1 FTG1* FTG2*

### Buses and harness runs
bus RTM_IO[14..0] = port RTM_IO[14..0]
harness FSPI = sheet FHPC2/FPGA_FLASH
harness port AMC_P2P = sheet FMGT/AMC_P2P
harness port DP1 = sheet FMGT/DP1
harness port DP2 = sheet FMGT/DP2
harness port FAT_PIPE1 = sheet FMGT/FAT_PIPE1
harness port FAT_PIPE2 = sheet FMGT/FAT_PIPE2
harness port FMC1_FPGA_CLK_IN = sheet FHPC1/FMC_FPGA_CLK_IN
harness port FMC2_FPGA_CLK_IN = sheet FHPC2/FMC_FPGA_CLK_IN
harness port FPGA_CLK = sheet FSDRAM/FPGA_CLK
harness port FPGA_I2C = sheet FHPC1/FPGA_I2C
harness port GBT_CLOCK1 = sheet FMGT/GBT_CLOCK1
harness port GBT_CLOCK2 = sheet FMGT/GBT_CLOCK2
harness port HA1 = sheet FHPC1/HA1
harness port HA2 = sheet FHPC2/HA2
harness port HB1 = sheet FHPC1/HB1
harness port HB2 = sheet FHPC2/HB2
harness port LA1 = sheet FHPC1/LA1
harness port LA2 = sheet FHPC2/LA2
harness port MGT_CLK = sheet FMGT/MGT_CLK
harness port MLVDS_FPGA = sheet FSDRAM/MLVDS_FPGA
harness port PLL_CTRL = sheet FHPC2/PLL_CTRL
harness port PORT0 = sheet FMGT/PORT0
harness port PORT1 = sheet FMGT/PORT1
harness port PORT2_MGT = sheet FMGT/PORT2_MGT
harness port PORT3_MGT = sheet FMGT/PORT3_MGT
harness port RTM_FPGA_CLK1 = sheet FMGT/RTM_FPGA_CLK1
harness port RTM_FPGA_CLK2 = sheet FMGT/RTM_FPGA_CLK2
harness port SDRAM = sheet FSDRAM/SDRAM
harness port SFP_GTP = sheet FMGT/SFP_GTP
harness port VREF1 = sheet FHPC1/VREF1
harness port VREF2 = sheet FHPC2/VREF2

### Layout directives
net class SE_SIG: DONE, FLASH_CLK, FLASH_CLK_R, FLASH_CS_MUX, FLASH_CSn, FLASH_CSn_R, FLASH_D2, FLASH_D2_Ra, FLASH_D3, FLASH_D3_Ra, FLASH_FCS_~{B}, FLASH_Q/D1, FLASH_Q_Ra, FLASH_SI/D0, FPGA_CCLK, PROGRAM_B
net class SE50: DONE, FLASH_CLK, FLASH_CLK_R, FLASH_CS_MUX, FLASH_CSn, FLASH_CSn_R, FLASH_D2, FLASH_D2_Ra, FLASH_D3, FLASH_D3_Ra, FLASH_FCS_~{B}, FLASH_Q/D1, FLASH_Q_Ra, FLASH_SI/D0, FPGA_CCLK, PROGRAM_B
differential pair: Rx3LVDS_N, Rx3LVDS_P, Tx3LVDS_N, Tx3LVDS_P

### Notes on the sheet
- PCI Express x2
- MGT SW
- added for init_b optional dealy
- XC7A200T
  65,330,912 bits -> 16MB memory
  The configuration bank voltage select pin (CFGBVS) must be set to a High or Low in
  order to set the configuration-related I/O for 3.3V/2.5V or 1.8V operation,
  respectively. When CFGBVS is set to Low for 1.8V I/O operation, the VCCO supplies
  and I/O signals to bank 0, bank 14, and bank 15 must be 1.8V (or lower) to avoid
  device damage. See Configuration Bank Voltage Select, page 29 for further details
- (near Q9) Configuration Mode 	M[2:0] 	Bus Width 	CCLK Direction
  Master Serial 	000 	x1 		Output
  Master SPI 	001 	x1, x2, x4 		Output
  Master BPI 	010 	x8, x16 		Output
  Master SelectMAP 	100 	x8, x16 		Output
  JTAG 		101 	x1 		Not Applicable
  Slave SelectMAP 	110	 x8, x16, x32(1) 	Input
  Slave Serial(2) 	111 	x1 		Input
- SPI does not exidt actually :/
- Copyright CNPEM 2012.
  This documentation describes Open Hardware and is licensed under the CERN OHL v.1.1. You may redistribute and modify this documentation under the terms of the CERN OHL v.1.1. (http://ohwr.org/CERNOHL). This documentation is distributed WITHOUT ANY EXPRESS OR IMPLIED WARRANTY, INCLUDING OF MERCHANTABILITY, SATISFACTORY QUALITY AND FITNESS FOR A PARTICULAR PURPOSE. Please see the CERN OHL v.1.1 for applicable conditions.
- (in symbol R0402_0R_JUMPER) 1%
- (in symbol R0402_4K7_1%_0.0625W_100PPM) 1%
- (in symbol R0402_10K_1%_0.0625W_100PPM) 1%
- (in symbol R0402_10R_1%_0.0625W_200PPM) 1%
- (in symbol R0402_100K_1%_0.0625W_100PPM) 1%
- (in symbol R0402_100R_1%_0.0625W_100PPM) 1%
- (in symbol R0402_330R_1%_0.0625W_100PPM) 1%

### Library data of the parts
C398 C400 C595 C595x C768-C775 C875 C882 = CC0201_100NF_6.3V_10%_X5R: Non-polarised capacitor; Part Description: SMD Multilayer Chip Ceramic Capacitor; Manufacturer: GENERIC; Manufacturer1 Part Number: 02016D104KAT2A; Voltage: 6.3V; TC: X5R; Tolerance: ±10%; Table: Capacitors SMD; Part Number: CC0201_100NF_6.3V_10%_X5R; Component Kind: Standard; Component Type: Standard; Pin Count: 2; Value: 100nF; Status: Not Recommended; Manufacturer Part Number: CC0201_100NF_6.3V_10%_X5R; Case: 0201; Mounted: Yes; Socket: No; SMD: Yes; Manufacturer1 Example: AVX; Manufacturer1 ComponentHeight: 0.33mm; HelpURL: \\cern.ch\dfs\Applications\Altium\Datasheets\CC0201_X5R_AVX.pdf; Author: CERN DEM JLC; CreateDate: 2007-12-03; LatestRevisionDate: 2007-12-03
HS1 = HEAT_SINK_ATS-50350B-C2-R0: Heat sink BGA 35x35(44.9)mm
IC2#1 = XC7A350T-2FFG1156C: Artix-6 FPGA, 16 GTPs, 600 User I/Os, 1156-Pin BGA, Speed Grade 2, Commercial Grade, Pb-Free; Part Description: Artix-7 FPGA, 16 GTPs, 600 User I/Os, 1156-Pin BGA, Speed Grade 2, Commercial Grade, Pb-Free; Manufacturer: XILINX; Table: Logic; Part Number: XC7A200T-3FFG1156C; Component Kind: Standard; Component Type: Standard; Device: XC7A200T-3FFG1156C; PackageDescription: BGA, 1.00mm Pitch, Square; 1156 Pin, 34 Columns X 34 Rows, 35.00mm X 35.00mm X 3.350mm H; Manufacturer Part Number: XC7A200T-3FFG1156C; Pin Count: 1156; Case: BGA1156; Mounted: Yes; Socket: No; SMD: Yes; ComponentHeight: 3.35mm; HelpURL: \\cern.ch\dfs\Applications\Altium\Datasheets\XC7A350T-2FFG1156C.pdf; ComponentLink1URL: \\cern.ch\dfs\Applications\Altium\Datasheets\XC7A350T-2FFG1156C.pdf; ComponentLink1Description: Package/Pinout; Author: CERN DEM JLC; CreateDate: 2012-09-19; LatestRevisionDate: 2012-09-19
IC13 IC64 = M25P128-VME6G: 128 Mbit (Multilevel), low-voltage, Serial Flash memory with 50-MHz SPI bus interface; Manufacturer: NUMONYX; Table: Logic; Part Number: M25P128-VME6G; Component Kind: Standard; Component Type: Standard; Device: M25P128-VME6G; PackageDescription: SON,1.27mm,pitch; 8 pin,8.00mm W X 6.00mm L X 1.00mm H body (w/pullback leads,thermal tab 6.4 X 4.8mm), IPC Medium Density; Part Description: 128 Mbit (Multilevel), Low-Voltage, Serial Flash Memory With 50-MHz SPI Bus Interface; Manufacturer Part Number: M25P128-VME6G; Pin Count: 9; Case: SON8; Mounted: Yes; Socket: No; SMD: Yes; ComponentHeight: 1mm; HelpURL: \\cern.ch\dfs\Applications\Altium\Datasheets\M25P128-VME6G.pdf; Author: CERN DEM JLC; CreateDate: 2010-01-20; LatestRevisionDate: 2010-01-20
IC17 IC65 = M25P128-VMF6G: 128 Mbit (Multilevel), low-voltage, Serial Flash memory with 50-MHz SPI bus interface; Manufacturer: NUMONYX; Table: Logic; Part Number: M25P128-VMF6G; Component Kind: Standard; Component Type: Standard; Device: M25P128-VMF6G; PackageDescription: SOIC 16, Pitch 1.27mm - Body 7.5x10.3mm, IPC Medium Density; Part Description: 128 Mbit (Multilevel), Low-Voltage, Serial Flash Memory With 50-MHz SPI Bus Interface; Manufacturer Part Number: M25P128-VMF6G; Pin Count: 8; Case: SOIC16; Mounted: Yes; Socket: No; SMD: Yes; ComponentHeight: 2.65mm; HelpURL: \\cern.ch\dfs\Applications\Altium\Datasheets\M25P128-VMF6G.pdf; Author: CERN DEM JLC; CreateDate: 2010-01-20; LatestRevisionDate: 2010-10-21
IC68-IC71 = TXB0104PWR: 4-Bit Bidirectionnal Voltage-Level Translator; Part Description: 4-Bit Bidirectional Voltage-Level Translator with Automatic Direction Sensing and ±15kV ESD Protection; Manufacturer: TEXAS INSTRUMENTS; Table: Analog & Interface; Part Number: TXB0104PWR; Component Kind: Standard; Component Type: Standard; Device: TXB0104PWR; PackageDescription: SOP, 14-Leads, Body 5.1x4.5mm (max), Pitch 0.65mm, IPC Medium Density; Manufacturer Part Number: TXB0104PWR; Pin Count: 14; Case: TSSOP14; Mounted: Yes; Socket: No; SMD: Yes; ComponentHeight: 1.2mm; Author: CERN DEM JMW; HelpURL: \\cern.ch\dfs\Applications\Altium\Datasheets\TXB0104PWR.pdf; CreateDate: 2010-12-20; LatestRevisionDate: 2010-12-20
IC80 IC81 = NC7SZ157P6X: TinyLogic® UHS 2-Input Non-Inverting Multiplexer; Manufacturer: FAIRCHILD SEMICONDUCTOR; Table: Standard Logic; Part Number: NC7SZ157P6X; Component Kind: Standard; Component Type: Standard; Device: NC7SZ157P6X; PackageDescription: SOT363, 0.65mm pitch; 6 pin, 1.40mm W X 2.15mm L, IPC Medium Density; Part Description: TinyLogic® UHS 2-Input Non-Inverting Multiplexer; Manufacturer Part Number: NC7SZ157P6X; Pin Count: 6; Case: SOT363; Mounted: Yes; Socket: No; SMD: Yes; ComponentHeight: 1.1mm; Author: CERN DEM JLC; HelpURL: \\cern.ch\dfs\Applications\Altium\Datasheets\NC7SZ157P6X.pdf; CreateDate: 2012-03-22; LatestRevisionDate: 2012-03-22
LED16 = LED_0603R: LED 0603 red; Supplier 1: Newark; Supplier Part Number 1: 22M3004; Supplier 2: Newark; Supplier Part Number 2: 20M0618
Q9 = Q_BSS138
R57-R59 R158 R159 R162 R350 = R0402_10K_1%_0.0625W_100PPM: Resistor - 1%; Part Description: General Purpose Thick Film Chip Resistor; Manufacturer: GENERIC; Manufacturer1 Part Number: 232270671003L; TC: ±100ppm/°C; Table: Resistors SMD; Part Number: R0402_10K_1%_0.0625W_100PPM; Component Kind: Standard; Component Type: Standard; Pin Count: 2; Value: 10k; Status: Not recommended; Power: 0.0625W; Tolerance: ±1%; Manufacturer Part Number: R0402_10K_1%_0.0625W_100PPM; Case: 0402; Mounted: Yes; Socket: No; SMD: Yes; Manufacturer1 Example: YAGEO PHYCOMP; Manufacturer1 ComponentHeight: 0.4mm; HelpURL: \\cern.ch\dfs\Applications\Altium\Datasheets\R0402_Phycomp_RC0402.pdf; Author: CERN DEM JLC; CreateDate: 2007-12-03; LatestRevisionDate: 2012-10-17
R125 R126 R129 R130 R133 R291 R292 R294-R296 R298 R300 R303 R304 R351 = R0402_10R_1%_0.0625W_200PPM: Resistor - 1%; Part Description: General Purpose Thick Film Chip Resistor; Manufacturer: GENERIC; Manufacturer1 Part Number: 232270671009L; TC: ±200ppm/°C; Table: Resistors SMD; Part Number: R0402_10R_1%_0.0625W_200PPM; Component Kind: Standard; Component Type: Standard; Pin Count: 2; Value: 10; Status: Not recommended; Power: 0.0625W; Tolerance: ±1%; Manufacturer Part Number: R0402_10R_1%_0.0625W_200PPM; Case: 0402; Mounted: Yes; Socket: No; SMD: Yes; Manufacturer1 Example: YAGEO PHYCOMP; Manufacturer1 ComponentHeight: 0.4mm; HelpURL: \\cern.ch\dfs\Applications\Altium\Datasheets\R0402_Phycomp_RC0402.pdf; Author: CERN DEM JLC; CreateDate: 2009-06-24; LatestRevisionDate: 2012-10-17
R127 R131 R160 = R0402_4K7_1%_0.0625W_100PPM: Resistor - 1%; Part Description: General Purpose Thick Film Chip Resistor; Manufacturer: GENERIC; Manufacturer1 Part Number: 232270674702L; TC: ±100ppm/°C; Table: Resistors SMD; Part Number: R0402_4K7_1%_0.0625W_100PPM; Component Kind: Standard; Component Type: Standard; Pin Count: 2; Value: 4k7; Status: Not recommended; Power: 0.0625W; Tolerance: ±1%; Manufacturer Part Number: R0402_4K7_1%_0.0625W_100PPM; Case: 0402; Mounted: Yes; Socket: No; SMD: Yes; Manufacturer1 Example: YAGEO PHYCOMP; Manufacturer1 ComponentHeight: 0.4mm; HelpURL: \\cern.ch\dfs\Applications\Altium\Datasheets\R0402_Phycomp_RC0402.pdf; Author: CERN DEM JLC; CreateDate: 2007-12-03; LatestRevisionDate: 2012-10-17
R128 R322-R325 = R0402_0R_JUMPER: Resistor - 1%; Part Description: 1A (0.05R Max DC Resistance) Zero Ohm Jumper; Manufacturer: GENERIC; Manufacturer1 Part Number: 232270591001L; Value: 0; Table: Resistors SMD; Part Number: R0402_0R_JUMPER; Component Kind: Standard; Component Type: Standard; Pin Count: 2; Status: Not recommended; Manufacturer Part Number: R0402_0R_JUMPER; Case: 0402; Mounted: Yes; Socket: No; SMD: Yes; Manufacturer1 Example: YAGEO PHYCOMP; Manufacturer1 ComponentHeight: 0.4mm; HelpURL: \\cern.ch\dfs\Applications\Altium\Datasheets\R0402_Phycomp_RC0402.pdf; Author: CERN DEM JLC; CreateDate: 2007-12-03; LatestRevisionDate: 2012-10-17
R132 R161 = R0402_330R_1%_0.0625W_100PPM: Resistor - 1%; Part Description: General Purpose Thick Film Chip Resistor; Manufacturer: GENERIC; Manufacturer1 Part Number: 232270673301L; TC: ±100ppm/°C; Table: Resistors SMD; Part Number: R0402_330R_1%_0.0625W_100PPM; Component Kind: Standard; Component Type: Standard; Pin Count: 2; Value: 330; Status: Not recommended; Power: 0.0625W; Tolerance: ±1%; Manufacturer Part Number: R0402_330R_1%_0.0625W_100PPM; Case: 0402; Mounted: Yes; Socket: No; SMD: Yes; Manufacturer1 Example: YAGEO PHYCOMP; Manufacturer1 ComponentHeight: 0.4mm; HelpURL: \\cern.ch\dfs\Applications\Altium\Datasheets\R0402_Phycomp_RC0402.pdf; Author: CERN DEM JLC; CreateDate: 2007-12-03; LatestRevisionDate: 2012-10-17
R134 R138 = R0402_100R_1%_0.0625W_100PPM: Resistor - 1%; Part Description: General Purpose Thick Film Chip Resistor; Manufacturer: GENERIC; Manufacturer1 Part Number: 232270671001L; Value: 100; TC: ±100ppm/°C; Table: Resistors SMD; Part Number: R0402_100R_1%_0.0625W_100PPM; Component Kind: Standard; Component Type: Standard; Pin Count: 2; Status: Not recommended; Power: 0.0625W; Tolerance: ±1%; Manufacturer Part Number: R0402_100R_1%_0.0625W_100PPM; Case: 0402; Mounted: Yes; Socket: No; SMD: Yes; Manufacturer1 Example: YAGEO PHYCOMP; Manufacturer1 ComponentHeight: 0.4mm; HelpURL: \\cern.ch\dfs\Applications\Altium\Datasheets\R0402_Phycomp_RC0402.pdf; Author: CERN DEM JLC; CreateDate: 2007-12-03; LatestRevisionDate: 2012-10-17
R293 = R0402_0R_JUMPER: Resistor - 1%; Part Description: 1A (0.05R Max DC Resistance) Zero Ohm Jumper; Manufacturer: GENERIC; Manufacturer1 Part Number: 232270591001L; Table: Resistors SMD; Part Number: R0402_0R_JUMPER; Component Kind: Standard; Component Type: Standard; Pin Count: 2; Value: 0; Status: Not recommended; Manufacturer Part Number: R0402_0R_JUMPER; Case: 0402; Mounted: Yes; Socket: No; SMD: Yes; Manufacturer1 Example: YAGEO PHYCOMP; Manufacturer1 ComponentHeight: 0.4mm; HelpURL: \\cern.ch\dfs\Applications\Altium\Datasheets\R0402_Phycomp_RC0402.pdf; Author: CERN DEM JLC; CreateDate: 2007-12-03; LatestRevisionDate: 2012-10-17
R297 R301 R302 = R0402_100K_1%_0.0625W_100PPM: Resistor - 1%; Part Description: General Purpose Thick Film Chip Resistor; Manufacturer: GENERIC; Manufacturer1 Part Number: 232270671004L; TC: ±100ppm/°C; Table: Resistors SMD; Part Number: R0402_100K_1%_0.0625W_100PPM; Component Kind: Standard; Component Type: Standard; Pin Count: 2; Value: 100k; Status: Not recommended; Power: 0.0625W; Tolerance: ±1%; Manufacturer Part Number: R0402_100K_1%_0.0625W_100PPM; Case: 0402; Mounted: Yes; Socket: No; SMD: Yes; Manufacturer1 Example: YAGEO PHYCOMP; Manufacturer1 ComponentHeight: 0.4mm; HelpURL: \\cern.ch\dfs\Applications\Altium\Datasheets\R0402_Phycomp_RC0402.pdf; Author: CERN DEM JLC; CreateDate: 2007-12-03; LatestRevisionDate: 2012-10-17

## Sheet FPGA_SDRAM.SchDoc
size A3; DocumentNumber: 18; SheetNumber: 18; SheetTotal: 30
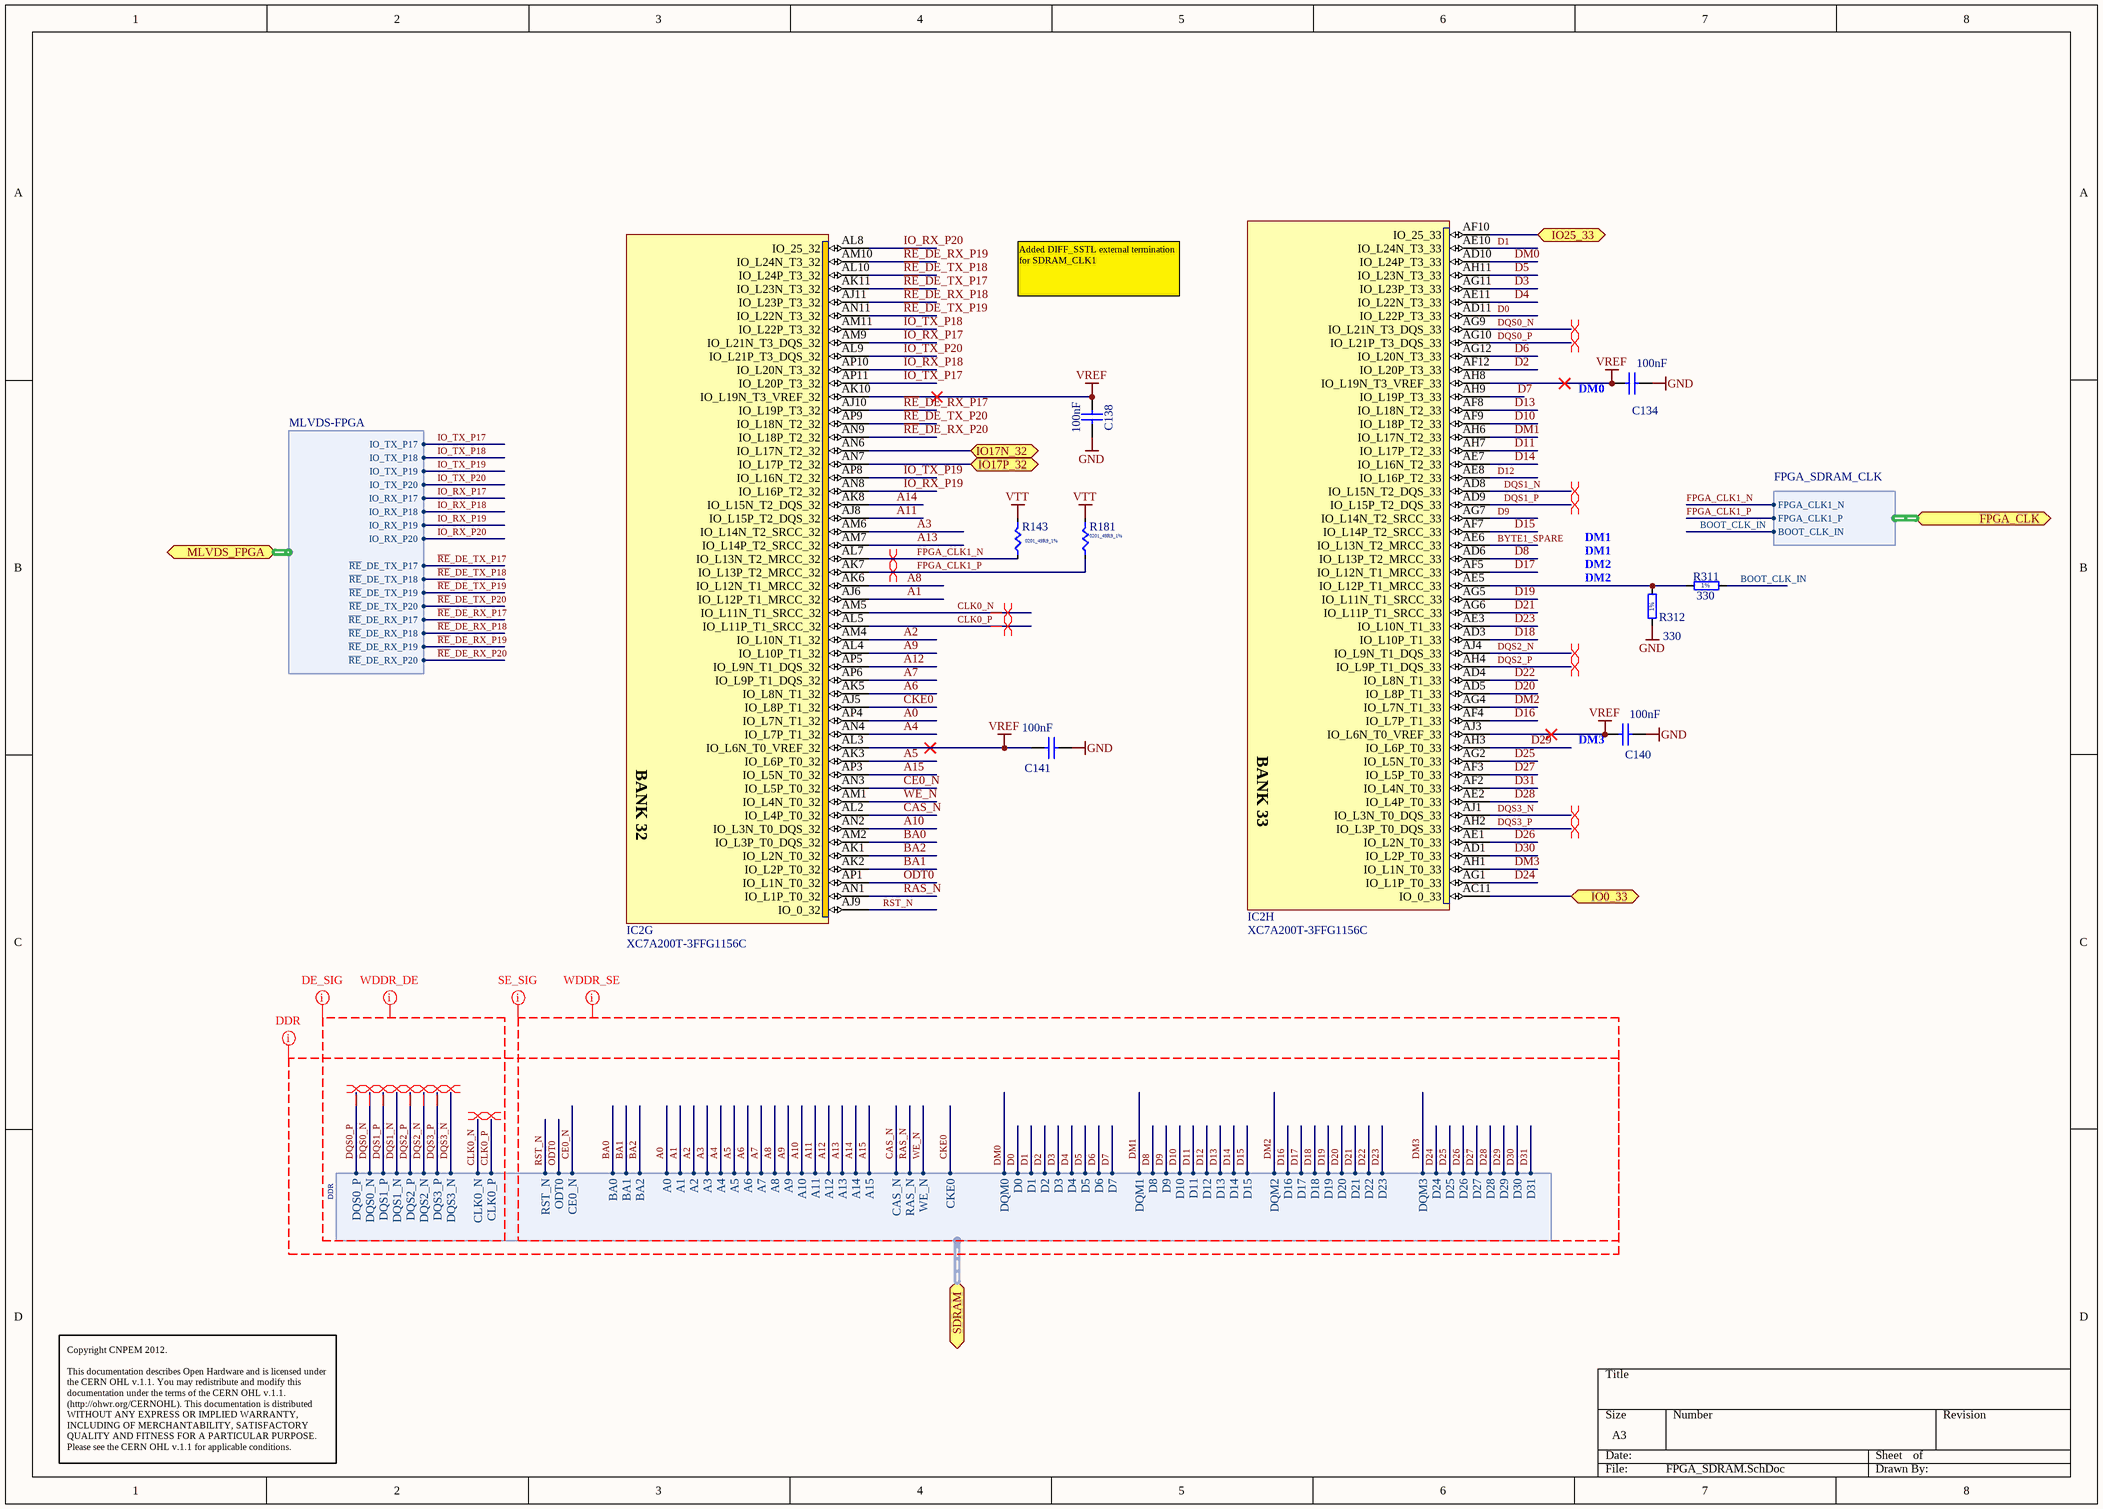
[diagram p2: FPGA_SDRAM.SchDoc]

### Parts
(Parts that share a designator on the sheet are numbered #1, #2 ... from top to bottom, then left to right.)
C134  100nF  [CAPC0603X33N]
C138  100nF  [CAPC0603X33N]
C140  100nF  [CAPC0603X33N]
C141  100nF  [CAPC0603X33N]
IC2#2  XC7A200T-3FFG1156C  [BGA1156C100P34X34_3500X3500X335]  (parts G,H of 23)
R143  0201_49R9_1%  [RESC0603X40N]
R181  0201_49R9_1%  [RESC0603X40N]
R311  330  [RESC1005X40N]
R312  330  [RESC1005X40N]

### Ports
FPGA_CLK (harness FPGA_SDRAM_CLK), IO0_33 (bidir), IO17N_32 (bidir), IO17P_32 (bidir), IO25_33 (bidir), MLVDS_FPGA (harness MLVDS-FPGA), SDRAM (harness DDR)

### Harnesses
DDR: CKE0, A0, A1, A2, A3, A4, A5, A7, A8, A9, A10, A11, A12, A13, BA0, BA1, BA2, A14, A15, CAS_N, RAS_N, WE_N, CE0_N, A6, D0, D1, D2, D3, D4, D5, D6, D7, D8, D9, D10, D11, D12, D13, D14, D15, CLK0_N, CLK0_P, ODT0, RST_N, D16, D17, D18, D19, D20, D21, D22, D23, D24, D25, D26, D27, D28, D29, D30, D31, DQS0_P, DQS1_P, DQS0_N, DQS1_N, DQS3_N, DQS3_P, DQS2_P, DQS2_N, DQM0, DQM1, DQM2, DQM3
MLVDS-FPGA: IO_TX_P17, IO_TX_P18, IO_TX_P19, IO_TX_P20, IO_RX_P17, IO_RX_P18, IO_RX_P19, IO_RX_P20, ~{RE}_DE_TX_P17, ~{RE}_DE_TX_P18, ~{RE}_DE_TX_P19, ~{RE}_DE_TX_P20, ~{RE}_DE_RX_P17, ~{RE}_DE_RX_P18, ~{RE}_DE_RX_P19, ~{RE}_DE_RX_P20
FPGA_SDRAM_CLK: FPGA_CLK1_N, FPGA_CLK1_P, BOOT_CLK_IN

### Nets
GND: C134.2 C138.2 C140.2 C141.2 R312.1
VREF: C134.1 C138.1 C140.1 C141.1 IC2#2.AH8(IO_L19N_T3_VREF_33) IC2#2.AJ3(IO_L6N_T0_VREF_33) IC2#2.AK10(IO_L19N_T3_VREF_32) IC2#2.AL3(IO_L6N_T0_VREF_32)
VTT: R143.1(+) R181.1(+)
A0: IC2#2.AP4(IO_L7N_T1_32) ; port SDRAM.A0
A1: IC2#2.AJ6(IO_L12P_T1_MRCC_32) ; port SDRAM.A1
A2: IC2#2.AM4(IO_L10N_T1_32) ; port SDRAM.A2
A3: IC2#2.AM6(IO_L14N_T2_SRCC_32) ; port SDRAM.A3
A4: IC2#2.AN4(IO_L7P_T1_32) ; port SDRAM.A4
A5: IC2#2.AK3(IO_L6P_T0_32) ; port SDRAM.A5
A6: IC2#2.AK5(IO_L8N_T1_32) ; port SDRAM.A6
A7: IC2#2.AP6(IO_L9P_T1_DQS_32) ; port SDRAM.A7
A8: IC2#2.AK6(IO_L12N_T1_MRCC_32) ; port SDRAM.A8
A9: IC2#2.AL4(IO_L10P_T1_32) ; port SDRAM.A9
A10: IC2#2.AN2(IO_L3N_T0_DQS_32) ; port SDRAM.A10
A11: IC2#2.AJ8(IO_L15P_T2_DQS_32) ; port SDRAM.A11
A12: IC2#2.AP5(IO_L9N_T1_DQS_32) ; port SDRAM.A12
A13: IC2#2.AM7(IO_L14P_T2_SRCC_32) ; port SDRAM.A13
A14: IC2#2.AK8(IO_L15N_T2_DQS_32) ; port SDRAM.A14
A15: IC2#2.AP3(IO_L5N_T0_32) ; port SDRAM.A15
BA0: IC2#2.AM2(IO_L3P_T0_DQS_32) ; port SDRAM.BA0
BA1: IC2#2.AK2(IO_L2P_T0_32) ; port SDRAM.BA1
BA2: IC2#2.AK1(IO_L2N_T0_32) ; port SDRAM.BA2
BOOT_CLK_IN: R311.2 ; port FPGA_CLK.BOOT_CLK_IN
BYTE1_SPARE: IC2#2.AE6(IO_L13N_T2_MRCC_33)
CAS_N: IC2#2.AL2(IO_L4P_T0_32) ; port SDRAM.CAS_N
CE0_N: IC2#2.AN3(IO_L5P_T0_32) ; port SDRAM.CE0_N
CKE0: IC2#2.AJ5(IO_L8P_T1_32) ; port SDRAM.CKE0
CLK0_N: IC2#2.AM5(IO_L11N_T1_SRCC_32) ; port SDRAM.CLK0_N
CLK0_P: IC2#2.AL5(IO_L11P_T1_SRCC_32) ; port SDRAM.CLK0_P
D0: IC2#2.AD11(IO_L22P_T3_33) ; port SDRAM.D0
D1: IC2#2.AE10(IO_L24N_T3_33) ; port SDRAM.D1
D2: IC2#2.AF12(IO_L20P_T3_33) ; port SDRAM.D2
D3: IC2#2.AG11(IO_L23P_T3_33) ; port SDRAM.D3
D4: IC2#2.AE11(IO_L22N_T3_33) ; port SDRAM.D4
D5: IC2#2.AH11(IO_L23N_T3_33) ; port SDRAM.D5
D6: IC2#2.AG12(IO_L20N_T3_33) ; port SDRAM.D6
D7: IC2#2.AH9(IO_L19P_T3_33) ; port SDRAM.D7
D8: IC2#2.AD6(IO_L13P_T2_MRCC_33) ; port SDRAM.D8
D9: IC2#2.AG7(IO_L14N_T2_SRCC_33) ; port SDRAM.D9
D10: IC2#2.AF9(IO_L18P_T2_33) ; port SDRAM.D10
D11: IC2#2.AH7(IO_L17P_T2_33) ; port SDRAM.D11
D12: IC2#2.AE8(IO_L16P_T2_33) ; port SDRAM.D12
D13: IC2#2.AF8(IO_L18N_T2_33) ; port SDRAM.D13
D14: IC2#2.AE7(IO_L16N_T2_33) ; port SDRAM.D14
D15: IC2#2.AF7(IO_L14P_T2_SRCC_33) ; port SDRAM.D15
D16: IC2#2.AF4(IO_L7P_T1_33) ; port SDRAM.D16
D17: IC2#2.AF5(IO_L12N_T1_MRCC_33) ; port SDRAM.D17
D18: IC2#2.AD3(IO_L10P_T1_33) ; port SDRAM.D18
D19: IC2#2.AG5(IO_L11N_T1_SRCC_33) ; port SDRAM.D19
D20: IC2#2.AD5(IO_L8P_T1_33) ; port SDRAM.D20
D21: IC2#2.AG6(IO_L11P_T1_SRCC_33) ; port SDRAM.D21
D22: IC2#2.AD4(IO_L8N_T1_33) ; port SDRAM.D22
D23: IC2#2.AE3(IO_L10N_T1_33) ; port SDRAM.D23
D24: IC2#2.AG1(IO_L1P_T0_33) ; port SDRAM.D24
D25: IC2#2.AG2(IO_L5N_T0_33) ; port SDRAM.D25
D26: IC2#2.AE1(IO_L2N_T0_33) ; port SDRAM.D26
D27: IC2#2.AF3(IO_L5P_T0_33) ; port SDRAM.D27
D28: IC2#2.AE2(IO_L4P_T0_33) ; port SDRAM.D28
D29: IC2#2.AH3(IO_L6P_T0_33) ; port SDRAM.D29
D30: IC2#2.AD1(IO_L2P_T0_33) ; port SDRAM.D30
D31: IC2#2.AF2(IO_L4N_T0_33) ; port SDRAM.D31
DM0: IC2#2.AD10(IO_L24P_T3_33) ; port SDRAM.DQM0
DM1: IC2#2.AH6(IO_L17N_T2_33) ; port SDRAM.DQM1
DM2: IC2#2.AG4(IO_L7N_T1_33) ; port SDRAM.DQM2
DM3: IC2#2.AH1(IO_L1N_T0_33) ; port SDRAM.DQM3
DQS0_N: IC2#2.AG9(IO_L21N_T3_DQS_33) ; port SDRAM.DQS0_N
DQS0_P: IC2#2.AG10(IO_L21P_T3_DQS_33) ; port SDRAM.DQS0_P
DQS1_N: IC2#2.AD8(IO_L15N_T2_DQS_33) ; port SDRAM.DQS1_N
DQS1_P: IC2#2.AD9(IO_L15P_T2_DQS_33) ; port SDRAM.DQS1_P
DQS2_N: IC2#2.AJ4(IO_L9N_T1_DQS_33) ; port SDRAM.DQS2_N
DQS2_P: IC2#2.AH4(IO_L9P_T1_DQS_33) ; port SDRAM.DQS2_P
DQS3_N: IC2#2.AJ1(IO_L3N_T0_DQS_33) ; port SDRAM.DQS3_N
DQS3_P: IC2#2.AH2(IO_L3P_T0_DQS_33) ; port SDRAM.DQS3_P
FPGA_CLK1_N: IC2#2.AL7(IO_L13N_T2_MRCC_32) R143.2(-) ; port FPGA_CLK.FPGA_CLK1_N
FPGA_CLK1_P: IC2#2.AK7(IO_L13P_T2_MRCC_32) R181.2(-) ; port FPGA_CLK.FPGA_CLK1_P
IO0_33: IC2#2.AC11(IO_0_33) ; port IO0_33
IO17N_32: IC2#2.AN6(IO_L17N_T2_32) ; port IO17N_32
IO17P_32: IC2#2.AN7(IO_L17P_T2_32) ; port IO17P_32
IO25_33: IC2#2.AF10(IO_25_33) ; port IO25_33
IO_RX_P17: IC2#2.AM9(IO_L21N_T3_DQS_32) ; port MLVDS_FPGA.IO_RX_P17
IO_RX_P18: IC2#2.AP10(IO_L20N_T3_32) ; port MLVDS_FPGA.IO_RX_P18
IO_RX_P19: IC2#2.AN8(IO_L16P_T2_32) ; port MLVDS_FPGA.IO_RX_P19
IO_RX_P20: IC2#2.AL8(IO_25_32) ; port MLVDS_FPGA.IO_RX_P20
IO_TX_P17: IC2#2.AP11(IO_L20P_T3_32) ; port MLVDS_FPGA.IO_TX_P17
IO_TX_P18: IC2#2.AM11(IO_L22P_T3_32) ; port MLVDS_FPGA.IO_TX_P18
IO_TX_P19: IC2#2.AP8(IO_L16N_T2_32) ; port MLVDS_FPGA.IO_TX_P19
IO_TX_P20: IC2#2.AL9(IO_L21P_T3_DQS_32) ; port MLVDS_FPGA.IO_TX_P20
ODT0: IC2#2.AP1(IO_L1N_T0_32) ; port SDRAM.ODT0
~{RE}_DE_RX_P17: IC2#2.AJ10(IO_L19P_T3_32) ; port MLVDS_FPGA.~{RE}_DE_RX_P17
~{RE}_DE_RX_P18: IC2#2.AJ11(IO_L23P_T3_32) ; port MLVDS_FPGA.~{RE}_DE_RX_P18
~{RE}_DE_RX_P19: IC2#2.AM10(IO_L24N_T3_32) ; port MLVDS_FPGA.~{RE}_DE_RX_P19
~{RE}_DE_RX_P20: IC2#2.AN9(IO_L18P_T2_32) ; port MLVDS_FPGA.~{RE}_DE_RX_P20
~{RE}_DE_TX_P17: IC2#2.AK11(IO_L23N_T3_32) ; port MLVDS_FPGA.~{RE}_DE_TX_P17
~{RE}_DE_TX_P18: IC2#2.AL10(IO_L24P_T3_32) ; port MLVDS_FPGA.~{RE}_DE_TX_P18
~{RE}_DE_TX_P19: IC2#2.AN11(IO_L22N_T3_32) ; port MLVDS_FPGA.~{RE}_DE_TX_P19
~{RE}_DE_TX_P20: IC2#2.AP9(IO_L18N_T2_32) ; port MLVDS_FPGA.~{RE}_DE_TX_P20
RAS_N: IC2#2.AN1(IO_L1P_T0_32) ; port SDRAM.RAS_N
RST_N: IC2#2.AJ9(IO_0_32) ; port SDRAM.RST_N
WE_N: IC2#2.AM1(IO_L4N_T0_32) ; port SDRAM.WE_N
NetIC2#2_AE5: IC2#2.AE5(IO_L12P_T1_MRCC_33) R311.1 R312.2

### Layout directives
differential pair: CLK0_N, CLK0_P, DQS0_N, DQS0_P, DQS1_N, DQS1_P, DQS2_N, DQS2_P, DQS3_N, DQS3_P, FPGA_CLK1_N, FPGA_CLK1_P
net class DDR: A0, A1, A2, A3, A4, A5, A6, A7, A8, A9, A10, A11, A12, A13, A14, A15, BA0, BA1, BA2, CAS_N, CE0_N, CKE0, CLK0_N, CLK0_P, D0, D1, D2, D3, D4, D5, D6, D7, D8, D9, D10, D11, D12, D13, D14, D15, D16, D17, D18, D19, D20, D21, D22, D23, D24, D25, D26, D27, D28, D29, D30, D31, DM0, DM1, DM2, DM3, DQS0_N, DQS0_P, DQS1_N, DQS1_P, DQS2_N, DQS2_P, DQS3_N, DQS3_P, ODT0, RAS_N, RST_N, WE_N
net class DE_SIG: CLK0_N, CLK0_P, DQS0_N, DQS0_P, DQS1_N, DQS1_P, DQS2_N, DQS2_P, DQS3_N, DQS3_P
net class SE_SIG: A0, A1, A2, A3, A4, A5, A6, A7, A8, A9, A10, A11, A12, A13, A14, A15, BA0, BA1, BA2, CAS_N, CE0_N, CKE0, D0, D1, D2, D3, D4, D5, D6, D7, D8, D9, D10, D11, D12, D13, D14, D15, D16, D17, D18, D19, D20, D21, D22, D23, D24, D25, D26, D27, D28, D29, D30, D31, DM0, DM1, DM2, DM3, ODT0, RAS_N, RST_N, WE_N
net class WDDR_DE: CLK0_N, CLK0_P, DQS0_N, DQS0_P, DQS1_N, DQS1_P, DQS2_N, DQS2_P, DQS3_N, DQS3_P
net class WDDR_SE: A0, A1, A2, A3, A4, A5, A6, A7, A8, A9, A10, A11, A12, A13, A14, A15, BA0, BA1, BA2, CAS_N, CE0_N, CKE0, D0, D1, D2, D3, D4, D5, D6, D7, D8, D9, D10, D11, D12, D13, D14, D15, D16, D17, D18, D19, D20, D21, D22, D23, D24, D25, D26, D27, D28, D29, D30, D31, DM0, DM1, DM2, DM3, ODT0, RAS_N, RST_N, WE_N

### Notes on the sheet
- Added DIFF_SSTL external termination for SDRAM_CLK1
- (near C134) DM0
- DM1
- (near R312) DM2
- (near C140) DM3
- Copyright CNPEM 2012.
  This documentation describes Open Hardware and is licensed under the CERN OHL v.1.1. You may redistribute and modify this documentation under the terms of the CERN OHL v.1.1. (http://ohwr.org/CERNOHL). This documentation is distributed WITHOUT ANY EXPRESS OR IMPLIED WARRANTY, INCLUDING OF MERCHANTABILITY, SATISFACTORY QUALITY AND FITNESS FOR A PARTICULAR PURPOSE. Please see the CERN OHL v.1.1 for applicable conditions.
- (in symbol R0402_330R_1%_0.0625W_100PPM) 1%
- (in symbol XC7A200T-3FFG1156C, part G) BANK 32
- (in symbol XC7A200T-3FFG1156C, part H) BANK 33
- (in symbol XC7A350T-2FFG1156C, part G) BANK 32
- (in symbol XC7A350T-2FFG1156C, part H) BANK 33

### Library data of the parts
C134 C138 C140 C141 = CC0201_100NF_6.3V_10%_X5R: as C398 on sheet FPGA; Part Number: CC0201_100NF_6.3V_10%_X5R; Component Kind: Standard; Component Type: Standard; Pin Count: 2; Value: 100nF; Status: Not Recommended; Manufacturer Part Number: CC0201_100NF_6.3V_10%_X5R; Case: 0201; Mounted: Yes; Socket: No; SMD: Yes; Manufacturer1 Example: AVX; Manufacturer1 ComponentHeight: 0.33mm; HelpURL: \\cern.ch\dfs\Applications\Altium\Datasheets\CC0201_X5R_AVX.pdf; Author: CERN DEM JLC; CreateDate: 2007-12-03; LatestRevisionDate: 2007-12-03
IC2#2 = XC7A200T-3FFG1156C: Artix-6 FPGA, 16 GTPs, 600 User I/Os, 1156-Pin BGA, Speed Grade 2, Commercial Grade, Pb-Free; Part Description: Artix-7 FPGA, 16 GTPs, 600 User I/Os, 1156-Pin BGA, Speed Grade 2, Commercial Grade, Pb-Free; Manufacturer: XILINX; Table: Logic; Part Number: XC7A200T-3FFG1156C; Component Kind: Standard; Component Type: Standard; Device: XC7A200T-3FFG1156C; PackageDescription: BGA, 1.00mm Pitch, Square; 1156 Pin, 34 Columns X 34 Rows, 35.00mm X 35.00mm X 3.350mm H; Manufacturer Part Number: XC7A200T-3FFG1156C; Pin Count: 1156; Case: BGA1156; Mounted: Yes; Socket: No; SMD: Yes; ComponentHeight: 3.35mm; HelpURL: \\cern.ch\dfs\Applications\Altium\Datasheets\XC7A350T-2FFG1156C.pdf; ComponentLink1URL: \\cern.ch\dfs\Applications\Altium\Datasheets\XC7A350T-2FFG1156C.pdf; ComponentLink1Description: Package/Pinout; Author: CERN DEM JLC; CreateDate: 2012-09-19; LatestRevisionDate: 2012-09-19
R143 R181 = SMT_0402_0201: MiscInfo: Biggest Cern Footprint [max height]; Document Name: FPGA_SDRAM.SchDoc; Part Number: SMT_0402_0201; FootprintSizeX (mm): 1.8; FootprintSizeY (mm): 0.9; FootprintRectangleArea (mm): 1.62; Thickness (Max) (mm): 0.4; FootprintAlias: 0402
R311 R312 = R0402_330R_1%_0.0625W_100PPM: as R132 on sheet FPGA; Part Number: R0402_330R_1%_0.0625W_100PPM; Component Kind: Standard; Component Type: Standard; Pin Count: 2; Value: 330; Status: Not recommended; Power: 0.0625W; Tolerance: ±1%; Manufacturer Part Number: R0402_330R_1%_0.0625W_100PPM; Case: 0402; Mounted: Yes; Socket: No; SMD: Yes; Manufacturer1 Example: YAGEO PHYCOMP; Manufacturer1 ComponentHeight: 0.4mm; HelpURL: \\cern.ch\dfs\Applications\Altium\Datasheets\R0402_Phycomp_RC0402.pdf; Author: CERN DEM JLC; CreateDate: 2007-12-03; LatestRevisionDate: 2012-10-17